# EAGLE design alexandru_ariton (EAGLE 9.7.0)
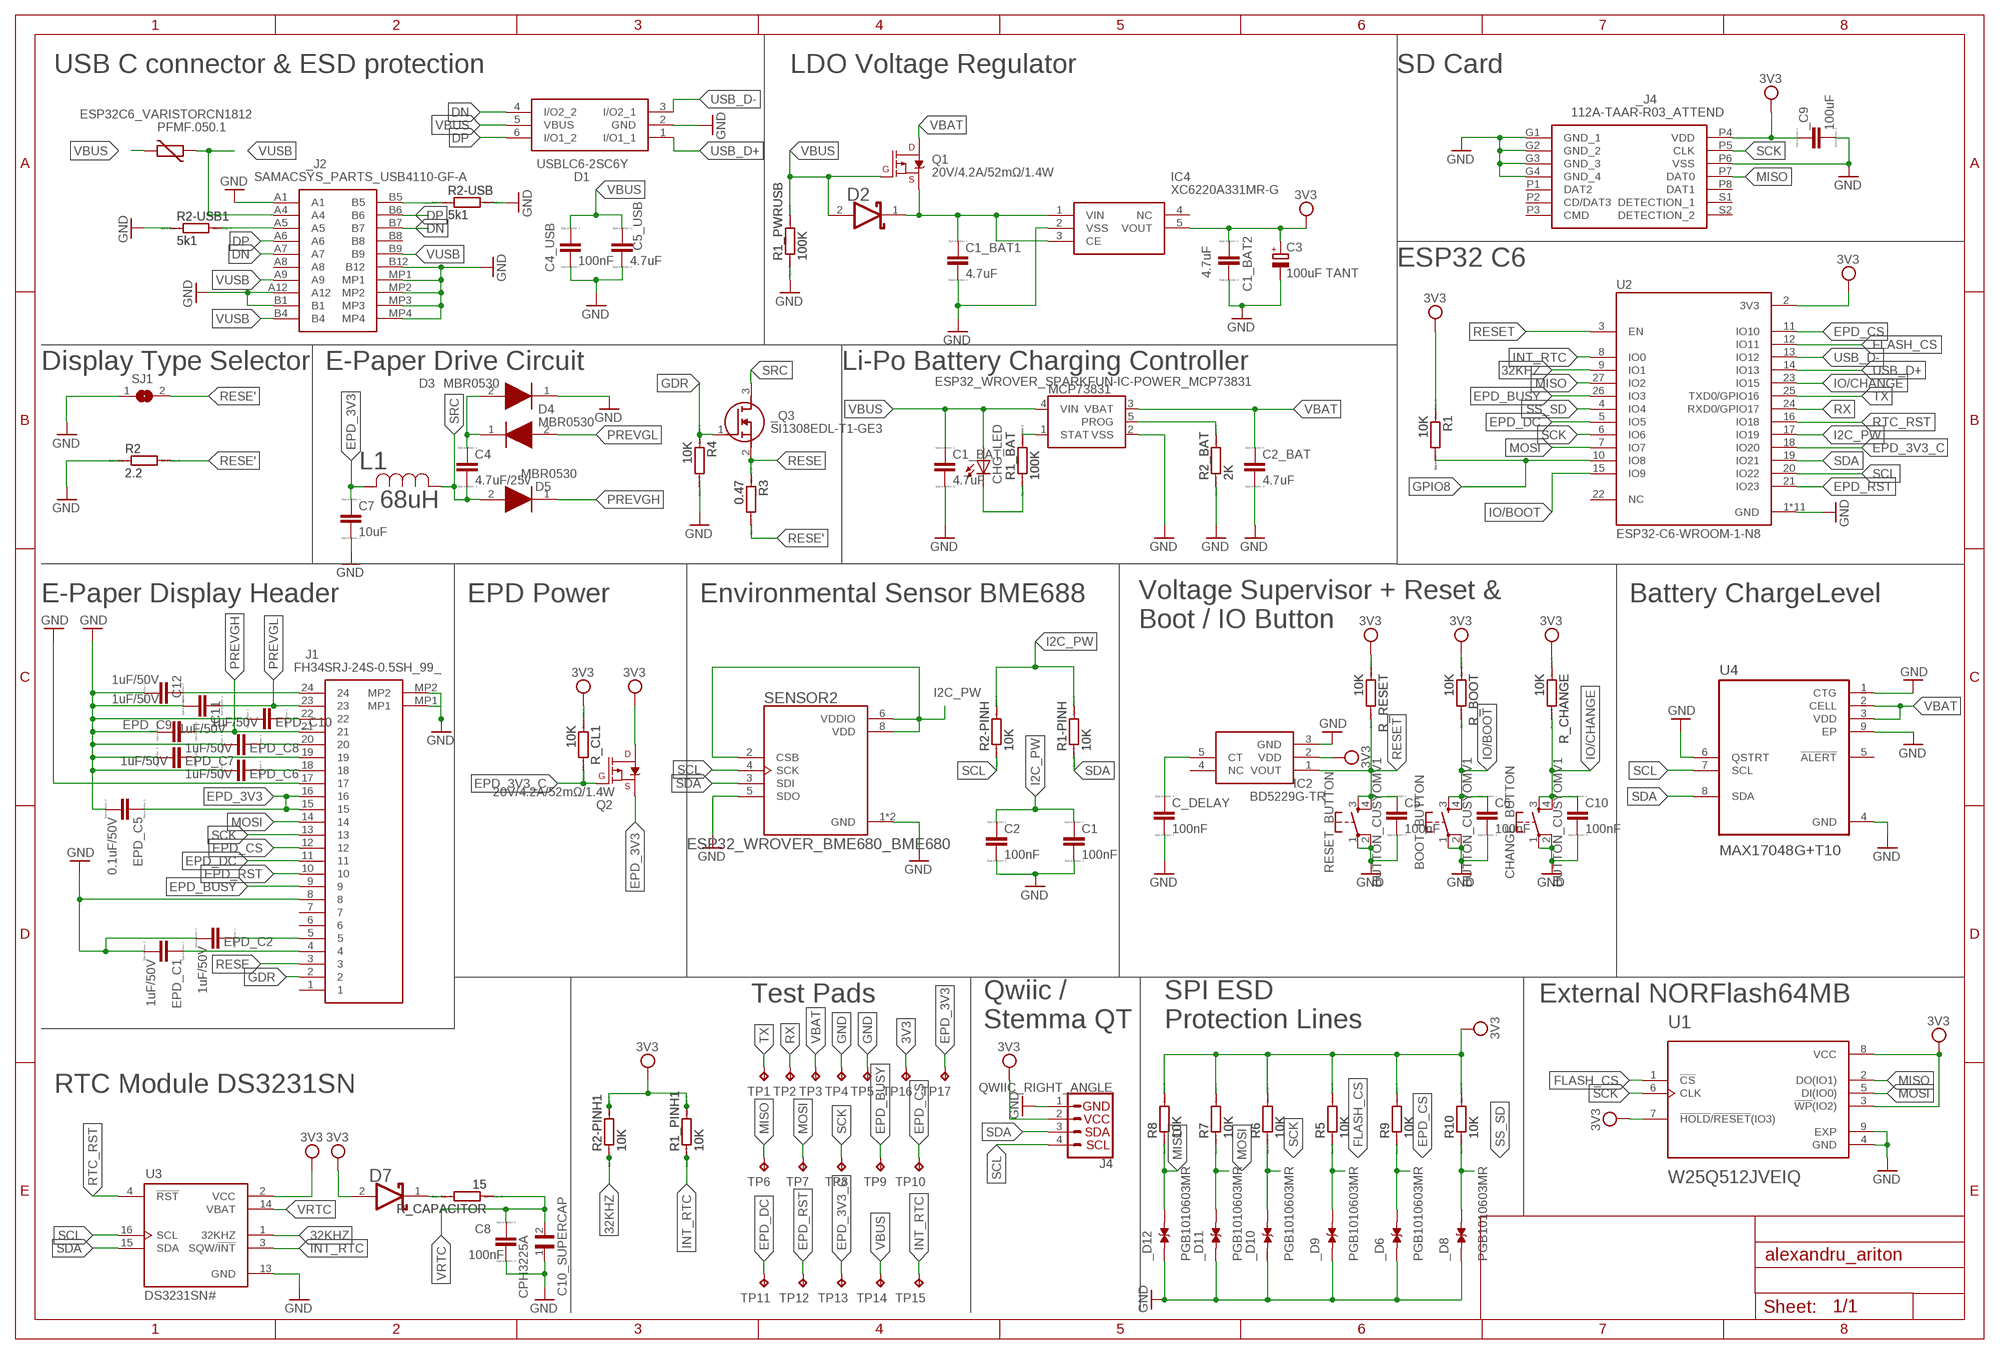
[diagram p0: schematic, sheet 1]

## Parts
_C9  100uF  EAGLE-LTSPICE_CC0402  [EAGLE-LTSPICE_C0402]
_D6  PGB1010603MR  [DIOC1608X36N]
_D8  PGB1010603MR  [DIOC1608X36N]
_D9  PGB1010603MR  [DIOC1608X36N]
_D10  PGB1010603MR  [DIOC1608X36N]
_D11  PGB1010603MR  [DIOC1608X36N]
_D12  PGB1010603MR  [DIOC1608X36N]
_J2  SAMACSYS_PARTS_USB4110-GF-A  [SAMACSYS_PARTS_USB4110GFA]
_J4  112A-TAAR-R03_ATTEND  [112ATAARR03ATTEND]
_Q3  SI1308EDL-T1-GE3  [SOT65P210X110-3N]
BOOT_BUTTON  BUTTON_CUSYOMV1  [MYBUTTON]
C1  100nF  EAGLE-LTSPICE_CC0402  [EAGLE-LTSPICE_C0402]
C1_BAT  4.7uF  EAGLE-LTSPICE_CC0402  [EAGLE-LTSPICE_C0402]
C1_BAT1  4.7uF  EAGLE-LTSPICE_CC0402  [EAGLE-LTSPICE_C0402]
C1_BAT2  4.7uF  EAGLE-LTSPICE_CC0402  [EAGLE-LTSPICE_C0402]
C2  100nF  EAGLE-LTSPICE_CC0402  [EAGLE-LTSPICE_C0402]
C2_BAT  4.7uF  EAGLE-LTSPICE_CC0402  [EAGLE-LTSPICE_C0402]
C3  100uF TANT  RCL_CPOL-EUCT3528  [RCL_CT3528]
C4  4.7uF/25v  EAGLE-LTSPICE_CC0402  [EAGLE-LTSPICE_C0402]
C4_USB  100nF  EAGLE-LTSPICE_CC0402  [EAGLE-LTSPICE_C0402]
C5  100nF  ESP32_WROVER_EAGLE-LTSPICE_CC0402  [ESP32_WROVER_EAGLE-LTSPICE_C0402]
C5_USB  4.7uF  EAGLE-LTSPICE_CC0402  [EAGLE-LTSPICE_C0402]
C6  100nF  ESP32_WROVER_EAGLE-LTSPICE_CC0402  [ESP32_WROVER_EAGLE-LTSPICE_C0402]
C7  10uF  EAGLE-LTSPICE_CC0402  [EAGLE-LTSPICE_C0402]
C8  100nF  EAGLE-LTSPICE_CC0402  [EAGLE-LTSPICE_C0402]
C10  100nF  ESP32_WROVER_EAGLE-LTSPICE_CC0402  [ESP32_WROVER_EAGLE-LTSPICE_C0402]
C10_SUPERCAP  CPH3225A  [CAPCP3225X100N]
C11  1uF/50V  EAGLE-LTSPICE_CC0402  [EAGLE-LTSPICE_C0402]
C12  1uF/50V  EAGLE-LTSPICE_CC0402  [EAGLE-LTSPICE_C0402]
C_DELAY  100nF  ESP32_WROVER_EAGLE-LTSPICE_CC0402  [ESP32_WROVER_EAGLE-LTSPICE_C0402]
CHANGE_BUTTON  BUTTON_CUSYOMV1  [MYBUTTON]
CHG_LED  ADAFRUIT_LEDCHIP-LED0603  [ADAFRUIT_CHIP-LED0603]
D1  USBLC6-2SC6Y  [SOT95P280X145-6N]
D2  ESP32_WROVER_AVX---SD0805S020S1R0_AVX_SD0805S020S1R0_0_0AVX_SD0805S020S1R0_0_0  [ESP32_WROVER_AVX---SD0805S020S1R0_AVX_SD0805S020S1R0_0]
D3  MBR0530  [SOD3716X135N]
D4  MBR0530  [SOD3716X135N]
D5  MBR0530  [SOD3716X135N]
D7  ESP32_WROVER_AVX---SD0805S020S1R0_AVX_SD0805S020S1R0_0_0AVX_SD0805S020S1R0_0_0  [ESP32_WROVER_AVX---SD0805S020S1R0_AVX_SD0805S020S1R0_0]
EPD_C1  1uF/50V  EAGLE-LTSPICE_CC0402  [EAGLE-LTSPICE_C0402]
EPD_C2  1uF/50V  EAGLE-LTSPICE_CC0402  [EAGLE-LTSPICE_C0402]
EPD_C5  0.1uF/50V  EAGLE-LTSPICE_CC0402  [EAGLE-LTSPICE_C0402]
EPD_C6  1uF/50V  EAGLE-LTSPICE_CC0402  [EAGLE-LTSPICE_C0402]
EPD_C7  1uF/50V  EAGLE-LTSPICE_CC0402  [EAGLE-LTSPICE_C0402]
EPD_C8  1uF/50V  EAGLE-LTSPICE_CC0402  [EAGLE-LTSPICE_C0402]
EPD_C9  1uF/50V  EAGLE-LTSPICE_CC0402  [EAGLE-LTSPICE_C0402]
EPD_C10  1uF/50V  EAGLE-LTSPICE_CC0402  [EAGLE-LTSPICE_C0402]
IC2  BD5229G-TR  [SOT95P280X125-5N]
IC4  XC6220A331MR-G  [SOT95P280X120-5N]
J1  FH34SRJ-24S-0.5SH_99_  [FH34SRJ24S05SH99]
J4  QWIIC_RIGHT_ANGLE  QWIIC_CONNECTORJS-1MM  [JST04_1MM_RA]
L1  68uH  744043680IND_4828-WE-TPC_WRE  [IND_4828-WE-TPC_WRE]
MCP73831  ESP32_WROVER_SPARKFUN-IC-POWER_MCP73831  [ESP32_WROVER_SPARKFUN-IC-POWER_SOT23-5]
PFMF.050.1  ESP32C6_VARISTORCN1812  [ESP32C6_VARISTOR_CT/CN1812]
Q1  20V/4.2A/52mΩ/1.4W  ESP32_WROVER_SPARKFUN-DISCRETESEMI_MOSFET_PCH-DMG2305UX-7  [ESP32_WROVER_SPARKFUN-DISCRETESEMI_SOT23-3]
Q2  20V/4.2A/52mΩ/1.4W  ESP32_WROVER_SPARKFUN-DISCRETESEMI_MOSFET_PCH-DMG2305UX-7  [ESP32_WROVER_SPARKFUN-DISCRETESEMI_SOT23-3]
R1  10K  ESP32_WROVER_EAGLE-LTSPICE_RR0402  [ESP32_WROVER_EAGLE-LTSPICE_R0402]
R1-PINH  10K  ESP32_WROVER_EAGLE-LTSPICE_RR0402  [ESP32_WROVER_EAGLE-LTSPICE_R0402]
R1_BAT  100K  ESP32_WROVER_EAGLE-LTSPICE_RR0402  [ESP32_WROVER_EAGLE-LTSPICE_R0402]
R1_PINH1  10K  ESP32_WROVER_EAGLE-LTSPICE_RR0402  [ESP32_WROVER_EAGLE-LTSPICE_R0402]
R1_PWRUSB  100K  ESP32_WROVER_EAGLE-LTSPICE_RR0402  [ESP32_WROVER_EAGLE-LTSPICE_R0402]
R2  2.2  ESP32_WROVER_EAGLE-LTSPICE_RR0402  [ESP32_WROVER_EAGLE-LTSPICE_R0402]
R2-PINH  10K  ESP32_WROVER_EAGLE-LTSPICE_RR0402  [ESP32_WROVER_EAGLE-LTSPICE_R0402]
R2-PINH1  10K  ESP32_WROVER_EAGLE-LTSPICE_RR0402  [ESP32_WROVER_EAGLE-LTSPICE_R0402]
R2-USB  5k1  ESP32_WROVER_EAGLE-LTSPICE_RR0402  [ESP32_WROVER_EAGLE-LTSPICE_R0402]
R2-USB1  5k1  ESP32_WROVER_EAGLE-LTSPICE_RR0402  [ESP32_WROVER_EAGLE-LTSPICE_R0402]
R2_BAT  2K  ESP32_WROVER_EAGLE-LTSPICE_RR0402  [ESP32_WROVER_EAGLE-LTSPICE_R0402]
R3  0.47  ESP32_WROVER_EAGLE-LTSPICE_RR0402  [ESP32_WROVER_EAGLE-LTSPICE_R0402]
R4  10K  ESP32_WROVER_EAGLE-LTSPICE_RR0402  [ESP32_WROVER_EAGLE-LTSPICE_R0402]
R5  10K  ESP32_WROVER_EAGLE-LTSPICE_RR0402  [ESP32_WROVER_EAGLE-LTSPICE_R0402]
R6  10K  ESP32_WROVER_EAGLE-LTSPICE_RR0402  [ESP32_WROVER_EAGLE-LTSPICE_R0402]
R7  10K  ESP32_WROVER_EAGLE-LTSPICE_RR0402  [ESP32_WROVER_EAGLE-LTSPICE_R0402]
R8  10K  ESP32_WROVER_EAGLE-LTSPICE_RR0402  [ESP32_WROVER_EAGLE-LTSPICE_R0402]
R9  10K  ESP32_WROVER_EAGLE-LTSPICE_RR0402  [ESP32_WROVER_EAGLE-LTSPICE_R0402]
R10  10K  ESP32_WROVER_EAGLE-LTSPICE_RR0402  [ESP32_WROVER_EAGLE-LTSPICE_R0402]
R_BOOT  10K  ESP32_WROVER_EAGLE-LTSPICE_RR0402  [ESP32_WROVER_EAGLE-LTSPICE_R0402]
R_CAPACITOR  15  ESP32_WROVER_EAGLE-LTSPICE_RR0402  [ESP32_WROVER_EAGLE-LTSPICE_R0402]
R_CHANGE  10K  ESP32_WROVER_EAGLE-LTSPICE_RR0402  [ESP32_WROVER_EAGLE-LTSPICE_R0402]
R_CL1  10K  ESP32_WROVER_EAGLE-LTSPICE_RR0402  [ESP32_WROVER_EAGLE-LTSPICE_R0402]
R_RESET  10K  ESP32_WROVER_EAGLE-LTSPICE_RR0402  [ESP32_WROVER_EAGLE-LTSPICE_R0402]
RESET_BUTTON  BUTTON_CUSYOMV1  [MYBUTTON]
SENSOR2  ESP32_WROVER_BME680_BME680  [ESP32_WROVER_BME680_PSON80P300X300X100-8N]
SJ1  SJ  [SJ]
TP1  TPTP20R  [TP20R]
TP2  TPTP20R  [TP20R]
TP3  TPTP20R  [TP20R]
TP4  TPTP20R  [TP20R]
TP5  TPTP20R  [TP20R]
TP6  TPTP20R  [TP20R]
TP7  TPTP20R  [TP20R]
TP8  TPTP20R  [TP20R]
TP9  TPTP20R  [TP20R]
TP10  TPTP20R  [TP20R]
TP11  TPTP20R  [TP20R]
TP12  TPTP20R  [TP20R]
TP13  TPTP20R  [TP20R]
TP14  TPTP20R  [TP20R]
TP15  TPTP20R  [TP20R]
TP16  TPTP20R  [TP20R]
TP17  TPTP20R  [TP20R]
U1  W25Q512JVEIQ  [SON127P600X800X80-9N]
U2  ESP32-C6-WROOM-1-N8  [XCVR_ESP32-C6-WROOM-1-N8]
U3  DS3231SN#  [SOIC127P1032X265-16N]
U4  MAX17048G+T10  [SON50P200X200X80-9N]

## Nets
3V3 [Semnale de Putere]: _C9.1 _J4.P4(VDD) C1_BAT2.1 C3.+ D7.2(ANODE) IC2.2(VDD) IC4.5(VOUT) J4.2 Q2.3(D) R1.1 R1_PINH1.2 R2-PINH1.2 R5.2 R6.2 R7.2 R8.2 R9.2 R10.2 R_BOOT.1 R_CHANGE.1 R_CL1.1 R_RESET.1 TP16.TP U1.3(!WP!(IO2)) U1.7(!HOLD!/!RESET!(IO3)) U1.8(VCC) U2.2(3V3) U3.2(VCC)
32KHZ: R2-PINH1.1 U2.9(IO1) U3.1(32KHZ)
DN: _J2.A7 _J2.B7 D1.4(I/O2_2)
DP: _J2.A6 _J2.B6 D1.6(I/O1_2)
EPD_3V3 [Semnale de Putere]: C7.1 EPD_C5.1 J1.15 J1.16 L1.2 Q2.2(S) TP17.TP
EPD_3V3_C [Semnale de Putere]: Q2.1(G) R_CL1.2 TP13.TP U2.18(IO20)
EPD_BUSY: J1.9 TP9.TP U2.26(IO3)
EPD_CS: _D6.2 J1.12 R9.1 TP10.TP U2.11(IO10)
EPD_DC: J1.11 TP11.TP U2.5(IO5)
EPD_RST: J1.10 TP12.TP U2.21(IO23)
FLASH_CS: _D9.2 R5.1 U1.1(!CS) U2.12(IO11)
GDR: _Q3.1(G) J1.2 R4.1
GND: _C9.2 _D6.1 _D8.1 _D9.1 _D10.1 _D11.1 _D12.1 _J2.A1 _J2.A12 _J2.B1 _J2.B12 _J2.MP1 _J2.MP2 _J2.MP3 _J2.MP4 _J4.G1(GND_1) _J4.G2(GND_2) _J4.G3(GND_3) _J4.G4(GND_4) _J4.P6(VSS) BOOT_BUTTON.1 BOOT_BUTTON.2 C1.2 C1_BAT1.2 C1_BAT2.2 C1_BAT.2 C2.2 C2_BAT.2 C3.- C4_USB.2 C5.2 C5_USB.2 C6.2 C7.2 C8.2 C10.2 C10_SUPERCAP.1 C11.2 C12.2 C_DELAY.2 CHANGE_BUTTON.1 CHANGE_BUTTON.2 D1.2(GND) D3.1(K) EPD_C1.2 EPD_C2.2 EPD_C5.2 EPD_C6.2 EPD_C7.2 EPD_C8.2 EPD_C9.2 EPD_C10.2 IC2.3(GND) IC4.2(VSS) J1.8 J1.17 J1.MP1 J1.MP2 J4.1 MCP73831.2(VSS) R1_PWRUSB.1 R2-USB1.1 R2-USB.2 R2.1 R2_BAT.1 R4.2 RESET_BUTTON.1 RESET_BUTTON.2 SENSOR2.1(GND) SENSOR2.5(SDO) SENSOR2.7(GND) SJ1.1 TP4.TP TP5.TP U1.4(GND) U1.9(EXP) U2.1(GND) U2.28(GND) U2.29_1(GND) U2.29_2(GND) U2.29_3(GND) U2.29_4(GND) U2.29_5(GND) U2.29_6(GND) U2.29_7(GND) U2.29_8(GND) U2.29_9(GND) U3.13(GND) U4.1(CTG) U4.4(GND) U4.6(QSTRT) U4.9(EP)
GPIO8: R1.2 U2.10(IO8)
I2C_PW: C1.1 C2.1 R1-PINH.2 R2-PINH.2 SENSOR2.2(CSB) SENSOR2.6(VDDIO) SENSOR2.8(VDD) U2.17(IO19)
INT_RTC: R1_PINH1.1 TP15.TP U2.8(IO0) U3.3(SQW/!INT)
IO/BOOT: BOOT_BUTTON.3 BOOT_BUTTON.4 C6.1 R_BOOT.2 U2.15(IO9)
IO/CHANGE: C10.1 CHANGE_BUTTON.3 CHANGE_BUTTON.4 R_CHANGE.2 U2.23(IO15)
MISO: _D12.2 _J4.P7(DAT0) R8.1 TP6.TP U1.2(DO(IO1)) U2.27(IO2)
MOSI: _D11.2 J1.14 R7.1 TP7.TP U1.5(DI(IO0)) U2.7(IO7)
N$1: _J2.B5 R2-USB.1
N$3: _J2.A5 R2-USB1.2
N$4: C1_BAT1.1 D2.1(CATHODE) IC4.1(VIN) IC4.3(CE) Q1.2(S)
N$5: MCP73831.1(STAT) R1_BAT.2
N$6: C4.1 D3.2(A) D4.1(K)
N$7: CHG_LED.C R1_BAT.1
N$8: MCP73831.5(PROG) R2_BAT.2
N$9: C12.1 J1.24
N$11: EPD_C10.1 J1.22
N$13: EPD_C8.1 J1.20
N$14: EPD_C7.1 J1.19
N$15: EPD_C6.1 J1.18
N$16: D7.1(CATHODE) R_CAPACITOR.2
N$19: C_DELAY.1 IC2.5(CT)
N$22: EPD_C1.1 J1.4
N$23: EPD_C2.1 J1.5
PREVGH: D5.1(K) EPD_C9.1 J1.21
PREVGL: C11.1 D4.2(A) J1.23
RESE: _Q3.2(S) J1.3 R3.1
RESE': R2.2 R3.2 SJ1.2
RESET: C5.1 IC2.1(VOUT) R_RESET.2 RESET_BUTTON.3 RESET_BUTTON.4 U2.3(EN)
RTC_RST: U2.16(IO18) U3.4(!RST)
RX: TP2.TP U2.24(RXD0/GPIO17)
SCK: _D10.2 _J4.P5(CLK) J1.13 R6.1 TP8.TP U1.6(CLK) U2.6(IO6)
SCL: J4.4 R2-PINH.1 SENSOR2.4(SCK) U2.20(IO22) U3.16(SCL) U4.7(SCL)
SDA: J4.3 R1-PINH.1 SENSOR2.3(SDI) U2.19(IO21) U3.15(SDA) U4.8(SDA)
SRC: _Q3.3(D) C4.2 D5.2(A) L1.1
SS_SD: _D8.2 R10.1 U2.4(IO4)
TX: TP1.TP U2.25(TXD0/GPIO16)
USB_D+: D1.1(I/O1_1) U2.14(IO13)
USB_D-: D1.3(I/O2_1) U2.13(IO12)
VBAT [Semnale de Putere]: C2_BAT.1 MCP73831.3(VBAT) Q1.3(D) TP3.TP U4.2(CELL) U4.3(VDD)
VBUS [Semnale de Putere]: C1_BAT.1 C4_USB.1 C5_USB.1 CHG_LED.A D1.5(VBUS) D2.2(ANODE) MCP73831.4(VIN) PFMF.050.1.2 Q1.1(G) R1_PWRUSB.2 TP14.TP
VRTC [Semnale de Putere]: C8.1 C10_SUPERCAP.2 R_CAPACITOR.1 U3.14(VBAT)
VUSB [Semnale de Putere]: _J2.A4 _J2.A9 _J2.B4 _J2.B9 PFMF.050.1.1
Unconnected: _J2.A8 _J2.B8 _J4.P1(DAT2) _J4.P2(CD/DAT3) _J4.P3(CMD) _J4.P8(DAT1) _J4.S1(DETECTION_1) _J4.S2(DETECTION_2) IC2.4(NC) IC4.4(NC) J1.1 J1.6 J1.7 U2.22(NC) U4.5(!ALERT)

## Notes on the sheet
- USB C connector & ESD protection | LDO Voltage Regulator | SD Card
- ESP32 C6
- Display Type Selector | E-Paper Drive Circuit | Li-Po Battery Charging Controller
- E-Paper Display Header | EPD Power | Environmental Sensor BME688 | Battery ChargeLevel
- Voltage Supervisor + Reset &
  Boot / IO Button
- Test Pads | External NORFlash64MB
- Qwiic /
  Stemma QT
- SPI ESD 
  Protection Lines
- RTC Module DS3231SN

## Library data of the parts
_C9 C1 C1_BAT C1_BAT1 C1_BAT2 C2 C2_BAT C4 C4_USB C5_USB C7 C8 C11 C12 EPD_C1 EPD_C2 EPD_C5-EPD_C10 = DeskAssistant v19 v1:EAGLE-LTSPICE_C: CAPACITOR, European symbol; SPICEMODEL: NONE; SPICEPREFIX: C
_D6 _D8-_D12 = DeskAssistant v19 v1:PGB1010603MR: Check availability <https://pricing.snapeda.com/parts/PGB1010603MR/Littelfuse%20Inc./view-part?ref=eda>; AVAILABILITY: In Stock; CHECK_PRICES: https://www.snapeda.com/parts/PGB1010603MR/Littelfuse/view-part/?ref=eda; DESCRIPTION: 150V (Typ) Clamp - Ipp Tvs Diode Surface Mount 0603 (1608 Metric); MF: Littelfuse Inc.; MP: PGB1010603MR; PACKAGE: 0603 Littelfuse Inc.; PRICE: None; PURCHASE-URL: https://www.snapeda.com/api/url_track_click_mouser/?unipart_id=5659453&manufacturer=Littelfuse Inc.&part_name=PGB1010603MR&search_term=None; SNAPEDA_LINK: https://www.snapeda.com/parts/PGB1010603MR/Littelfuse/view-part/?ref=snap
_J2 = DeskAssistant v19 v1:SAMACSYS_PARTS_USB4110-GF-A: CONN USB 2.0 TYPE-C R/A SMT Source: Datasheet <https://gct.co/files/drawings/usb4110.pdf>; DESCRIPTION: CONN USB 2.0 TYPE-C R/A SMT; HEIGHT: 3.26mm; MANUFACTURER_NAME: GCT (GLOBAL CONNECTOR TECHNOLOGY); MANUFACTURER_PART_NUMBER: USB4110-GF-A; MOUSER_PART_NUMBER: 640-USB4110-GF-A; MOUSER_PRICE-STOCK: https://www.mouser.co.uk/ProductDetail/GCT/USB4110-GF-A?qs=KUoIvG%2F9IlYiZvIXQjyJeA%3D%3D
_J4 = DeskAssistant v19 v1:112A-TAAR-R03_ATTEND: Micro SD Card Socket, Push-Push Type, Top Mount, SMT, H=1.83mm, 10u Source: Datasheet <https://www.attend.com.tw/data/download/file/112A-TAAR-R03.pdf>; DESCRIPTION: Micro SD Card Socket, Push-Push Type, Top Mount, SMT, H=1.83mm, 10u; HEIGHT: 1.9mm; MANUFACTURER_NAME: ATTEND; MANUFACTURER_PART_NUMBER: 112A-TAAR-R03 ATTEND
_Q3 = DeskAssistant v19 v1:SI1308EDL-T1-GE3: MOSFET N-Ch 30V 1.5A TrenchFET SC70 Vishay Si1308EDL-T1-GE3 N-channel MOSFET Transistor, 1.5 A, 30 V, 3-Pin SC-70 Source: Datasheet <https://componentsearchengine.com/Datasheets/1/SI1308EDL-T1-GE3.pdf> Check availability <https://pricing.snapeda.com/parts/SI1308EDL-T1-GE3/Vishay%20Siliconix/view-part?ref=eda>; AVAILABILITY: In Stock; CHECK_PRICES: https://www.snapeda.com/parts/SI1308EDL-T1-GE3/Vishay+Siliconix/view-part/?ref=eda; DESCRIPTION: Si1308EDL-T1-GE3 N-channel MOSFET Transistor, 1.5 A, 30 V, 3-Pin SC-70 | Siliconix / Vishay SI1308EDL-T1-GE3; MF: Vishay Siliconix; MP: SI1308EDL-T1-GE3; PACKAGE: SOT-323 Vishay Semiconductor; PRICE: None; PURCHASE-URL: https://www.snapeda.com/api/url_track_click_mouser/?unipart_id=274603&manufacturer=Vishay Siliconix&part_name=SI1308EDL-T1-GE3&search_term=None; SNAPEDA_LINK: https://www.snapeda.com/parts/SI1308EDL-T1-GE3/Vishay+Siliconix/view-part/?ref=snap
BOOT_BUTTON CHANGE_BUTTON RESET_BUTTON = DeskAssistant v19 v1:BUTTON_CUSYOMV1
C3 = DeskAssistant v19 v1:RCL_CPOL-EU: POLARIZED CAPACITOR, European symbol; SPICEPREFIX: C
C5 C6 C10 C_DELAY = DeskAssistant v19 v1:ESP32_WROVER_EAGLE-LTSPICE_C: CAPACITOR, European symbol; SPICEMODEL: NONE; SPICEPREFIX: C
C10_SUPERCAP = DeskAssistant v19 v1:CPH3225A: Cap 0.011F 3.3V 1210 Flat Check availability <https://pricing.snapeda.com/parts/CPH3225A/Seiko%20Instruments/view-part?ref=eda>; AVAILABILITY: Not in stock; CHECK_PRICES: https://www.snapeda.com/parts/CPH3225A/Seiko+Instruments/view-part/?ref=eda; DESCRIPTION: 11 mF (EDLC) Supercapacitor 3.3 V 1210 (3225 Metric) - -; MF: Seiko Instruments; MP: CPH3225A; PACKAGE: 1210 Seiko; PRICE: None; PURCHASE-URL: https://www.snapeda.com/api/url_track_click_mouser/?unipart_id=562593&manufacturer=Seiko Instruments&part_name=CPH3225A&search_term=None; SNAPEDA_LINK: https://www.snapeda.com/parts/CPH3225A/Seiko+Instruments/view-part/?ref=snap
CHG_LED = DeskAssistant v19 v1:ADAFRUIT_LED: LED OSRAM: - CHIPLED LG R971, LG N971, LY N971, LG Q971, LY Q971, LO R971, LY R971 LH N974, LH R974 LS Q976, LO Q976, LY Q976 LO Q996 - Hyper CHIPLED LW Q18S LB Q993, LB Q99A, LB R99A - SideLED LS A670, LO A670, LY A670, LG A670, LP A670 LB A673, LV A673, LT A673, LW A673 LH A674 LY A675 LS A676, LA A676, LO A676, LY A676, LW A676 LS A679, LY A679, LG A679 - Hyper Micro SIDELED® LS Y876, LA Y876, LO Y876, LY Y876 LT Y87S - SmartLED LW L88C, LW L88S LB L89C, LB L89S, LG L890 LS L89K, LO L89K, LY L89K LS L896, LA L896, LO L896, LY L896 - TOPLED LS T670, LO T670, LY T670, LG T670, LP T670 LSG T670, LSP T670, LSY T670, LOP T670, LYG T670 LG T671, LOG T671, LSG T671 LB T673, LV T673, LT T673, LW T673 LH T674 LS T676, LA T676, LO T676, LY T676, LB T676, LH T676, LSB T676, LW T676 LB T67C, LV T67C, LT T67C, LS T67K, LO T67K, LY T67K, LW E67C LS E67B, LA E67B, LO E67B, LY E67B, LB E67C, LV E67C, LT E67C LW T67C LS T679, LY T679, LG T679 LS T770, LO T770, LY T770, LG T770, LP T770 LB T773, LV T773, LT T773, LW T773 LH T774 LS E675, LA E675, LY E675, LS T675 LS T776, LA T776, LO T776, LY T776, LB T776 LHGB T686 LT T68C, LB T68C - Hyper Mini TOPLED® LB M676 - Mini TOPLED Santana® LG M470 LS M47K, LO M47K, LY M47K Source: http://www.osram.convergy.de/
D1 = DeskAssistant v19 v1:USBLC6-2SC6Y: Low Cap. ESD Protection Auto SOT-23-6 STMicroelectronics USBLC6-2SC6Y, Dual Uni-Directional TVS Diode Array, 6-Pin SOT-23 Source: Datasheet <https://componentsearchengine.com/Datasheets/1/USBLC6-2SC6Y.pdf> Check availability <https://pricing.snapeda.com/parts/USBLC6-2SC6Y/STMicroelectronics/view-part?ref=eda>; AVAILABILITY: In Stock; CHECK_PRICES: https://www.snapeda.com/parts/USBLC6-2SC6Y/STMicroelectronics/view-part/?ref=eda; DESCRIPTION: 17V Clamp 5A (8/20µs) Ipp Tvs Diode Surface Mount SOT-23-6; MF: STMicroelectronics; MP: USBLC6-2SC6Y; PACKAGE: SOT-23-6 STMicroelectronics; PRICE: None; SNAPEDA_LINK: https://www.snapeda.com/parts/USBLC6-2SC6Y/STMicroelectronics/view-part/?ref=snap
D2 D7 = DeskAssistant v19 v1:ESP32_WROVER_AVX---SD0805S020S1R0_AVX_SD0805S020S1R0_0_0: Schottky Barrier Rectifier Diode; CENTROID_NOT_SPECIFIED: No; DATASHEET: http://datasheets.avx.com/schottky.pdf; DIGIKEY_DESCRIPTION: DIODE SCHOTTKY 20V 1A 0805; DIGIKEY_PART_NUMBER: 478-7800-1-ND; LEAD_FREE: yes; MF: AVX; MOUSER_PART_NUMBER: 581-SD0805S020S1R0; PACKAGE: 0805 (2012 metric); PREFIX: D; ROHS: yes; TEMPERATURE_RANGE_HIGH: +125°C; TEMPERATURE_RANGE_LOW: -55°C
D3-D5 = DeskAssistant v19 v1:MBR0530: ON SEMICONDUCTOR - MBR0530 - DIODE, SCHOTTKY, 0.5A, 30V, SOD-123 Source: Datasheet <http://www.onsemi.com/pub/Collateral/MBR0530T1-D.PDF> Check availability <https://pricing.snapeda.com/parts/MBR0530/ON%20Semiconductor/view-part?ref=eda>; AVAILABILITY: In Stock; CHECK_PRICES: https://www.snapeda.com/parts/MBR0530/Onsemi/view-part/?ref=eda; DESCRIPTION: Diode Schottky 30 V 500mA Surface Mount SOD-123; MF: ON Semiconductor; MP: MBR0530; PACKAGE: SOD-123-2 ON Semiconductor; PRICE: None; PURCHASE-URL: https://www.snapeda.com/api/url_track_click_mouser/?unipart_id=179458&manufacturer=ON Semiconductor&part_name=MBR0530&search_term=None; SNAPEDA_LINK: https://www.snapeda.com/parts/MBR0530/Onsemi/view-part/?ref=snap
IC2 = DeskAssistant v19 v1:BD5229G-TR: Voltage Detector with Adjustable Delay Time: CMOS processes are utilized to develop high precision, low current consumption CMOS reset ICs that allow arbitrary setting of the delay time. The extensive lineup includes both Nch Open Drain and CMOS output types in a wide range of detection voltages (from 2.3V to 6.0V, in 0.1V steps), enabling selection of the ideal solution based on customer requirements. In addition, the entire series is of course both lead-free and RoHS-compliant. Source: Datasheet <https://datasheet.datasheetarchive.com/originals/distributors/Datasheets_SAMA/f2b9741ef86007909f138d561a359946.pdf>; DESCRIPTION: Voltage Detector with Adjustable Delay Time: CMOS processes are utilized to develop high precision, low current consumption CMOS reset ICs that allow arbitrary setting of the delay time. The extensive lineup includes both Nch Open Drain and CMOS output types in a wide range of detection voltages (from 2.3V to 6.0V, in 0.1V steps), enabling selection of the ideal solution based on customer requirements. In addition, the entire series is of course both lead-free and RoHS-compliant.; HEIGHT: 1.25mm; MANUFACTURER_NAME: ROHM Semiconductor; MANUFACTURER_PART_NUMBER: BD5229G-TR; MOUSER_PART_NUMBER: 755-BD5229G-TR; MOUSER_PRICE-STOCK: https://www.mouser.co.uk/ProductDetail/ROHM-Semiconductor/BD5229G-TR?qs=4kLU8WoGk0vvnhrrYwdszw%3D%3D
IC4 = DeskAssistant v19 v1:XC6220A331MR-G: LDO Voltage Regulators Source: Datasheet <https://www.torexsemi.com/file/xc6220/XC6220.pdf>; DESCRIPTION: LDO Voltage Regulators; HEIGHT: 1.2mm; MANUFACTURER_NAME: Torex; MANUFACTURER_PART_NUMBER: XC6220A331MR-G; MOUSER_PART_NUMBER: 865-XC6220A331MR-G; MOUSER_PRICE-STOCK: https://www.mouser.co.uk/ProductDetail/Torex-Semiconductor/XC6220A331MR-G?qs=AsjdqWjXhJ8ZSWznL1J0gg%3D%3D
J1 = DeskAssistant v19 v1:FH34SRJ-24S-0.5SH_99_: 24 Position FFC, FPC Connector Contacts, Top and Bottom 0.020" (0.50mm) Surface Mount, Right Angle Source: Datasheet <https://www.hirose.com/en/product/document?clcode=CL0580-1255-6-99&productname=FH34SRJ-24S-0.5SH(99)&series=FH34SRJ&documenttype=2DDrawing&lang=en&documentid=0000990903>; DESCRIPTION: 24 Position FFC, FPC Connector Contacts, Top and Bottom 0.020" (0.50mm) Surface Mount, Right Angle; HEIGHT: 1.1mm; MANUFACTURER_NAME: Hirose; MANUFACTURER_PART_NUMBER: FH34SRJ-24S-0.5SH(99); MOUSER_PART_NUMBER: 798-FH34SRJ24S05SH99; MOUSER_PRICE-STOCK: https://www.mouser.co.uk/ProductDetail/Hirose-Connector/FH34SRJ-24S-0.5SH99?qs=vcbW%252B4%252BSTIpKBl5ap9J8Fw%3D%3D
J4 = DeskAssistant v19 v1:QWIIC_CONNECTOR: SparkFun I2C Standard Qwiic Connector An SMD 1mm pitch JST connector makes it easy and quick (get it? Qwiic?) to connect I2C devices to each other. The Qwiic system <http://www.sparkfun.com/qwiic> enables fast and solderless connection between popular platforms and various sensors and actuators. We carry 200mm <https://www.sparkfun.com/products/14204>, 100mm <https://www.sparkfun.com/products/14205>, 50mm <https://www.sparkfun.com/products/14206>, and breadboard friendly <https://www.sparkfun.com/products/14207> Qwiic cables. We also offer 10 pcs strips <https://www.sparkfun.com/products/14323> the SMD connectors.; PROD_ID: CONN-13694
L1 = DeskAssistant v19 v1:744043680; COPYRIGHT: Copyright (C) 2024 Ultra Librarian. All rights reserved.; MANUFACTURER_PART_NUMBER: 744043680; MFR_NAME: Wurth Electronics
MCP73831 = DeskAssistant v19 v1:ESP32_WROVER_SPARKFUN-IC-POWER_MCP73831: MCP73831T Li-Ion, Li-Pol Controller Miniature single cell, fully integrated Li-Ion, Li-polymer charge management controller Datasheet <http://ww1.microchip.com/downloads/en/DeviceDoc/20001984g.pdf> SparkFun Products: SparkFun ESP32 Thing <https://www.sparkfun.com/products/13907> SparkFun 9DoF Razor IMU M0 <https://www.sparkfun.com/products/14001>; PROD_ID: IC-09995
PFMF.050.1 = DeskAssistant v19 v1:ESP32C6_VARISTOR: VARISTOR
Q1 Q2 = DeskAssistant v19 v1:ESP32_WROVER_SPARKFUN-DISCRETESEMI_MOSFET_PCH: P-channel MOSFETs Voltage controlled devices that allow control of high current outputs. SparkFun Products: SparkFun ESP32 Thing <https://www.sparkfun.com/products/13907> SparkFun ESP8266 Thing <https://www.sparkfun.com/products/13231> SparkFun Pi Servo HAT V2 <https://www.sparkfun.com/products/15316> DMG2305UX-7 (20V/4.2A/SOT23-3); PROD_ID: TRAN-14388
R1 R1-PINH R1_BAT R1_PINH1 R1_PWRUSB R2 R2-PINH R2-PINH1 R2-USB R2-USB1 R2_BAT R3-R10 R_BOOT R_CAPACITOR R_CHANGE R_CL1 R_RESET = DeskAssistant v19 v1:ESP32_WROVER_EAGLE-LTSPICE_R: RESISTOR, European symbol; SPICEMODEL: NONE; SPICEPREFIX: R
SENSOR2 = DeskAssistant v19 v1:ESP32_WROVER_BME680_BME680: Integrated Environmental Unit; AVAILABILITY: Unavailable; DESCRIPTION: Integrated Environmental Unit; MF: Bosch Sensortec; MP: BME680; PACKAGE: LGA-8 Bosch Tools; PRICE: None
SJ1 = DeskAssistant v19 v1:SJ: SMD solder JUMPER
TP1-TP17 = DeskAssistant v19 v1:TP: Test pad
U1 = DeskAssistant v19 v1:W25Q512JVEIQ: Check availability <https://pricing.snapeda.com/parts/W25Q512JVEIQ/Winbond%20Electronics/view-part?ref=eda>; AVAILABILITY: In Stock; CHECK_PRICES: https://www.snapeda.com/parts/W25Q512JVEIQ/Winbond+Electronics/view-part/?ref=eda; DESCRIPTION: FLASH - NOR Memory IC 512Mb (64M x 8) SPI - Quad I/O 133 MHz 8-WSON (8x6); MF: Winbond Electronics; MP: W25Q512JVEIQ; PACKAGE: Package; PRICE: None; SNAPEDA_LINK: https://www.snapeda.com/parts/W25Q512JVEIQ/Winbond+Electronics/view-part/?ref=snap
U2 = DeskAssistant v19 v1:ESP32-C6-WROOM-1-N8: Check availability <https://pricing.snapeda.com/parts/ESP32-C6-WROOM-1-N8/Espressif%20Systems/view-part?ref=eda>; AVAILABILITY: In Stock; CHECK_PRICES: https://www.snapeda.com/parts/ESP32-C6-WROOM-1-N8/Espressif+Systems/view-part/?ref=eda; DESCRIPTION: Multiprotocol Modules ESP32-C6 module, Wi-Fi 6 in 2.4 GHz band, Bluetooth 5, Zigbee 3.0 and Thread. ESP34-WROOM Compatible - ENGINEERING SAMPLE; MF: Espressif Systems; MP: ESP32-C6-WROOM-1-N8; PACKAGE: None; PRICE: None; SNAPEDA_LINK: https://www.snapeda.com/parts/ESP32-C6-WROOM-1-N8/Espressif+Systems/view-part/?ref=snap
U3 = DeskAssistant v19 v1:DS3231SN#: Real Time Clock Serial 16-Pin SOIC W T/R Check availability <https://pricing.snapeda.com/parts/DS3231SN%23/Analog%20Devices/view-part?ref=eda>; AVAILABILITY: In Stock; CHECK_PRICES: https://www.snapeda.com/parts/DS3231SN%23/Analog+Devices/view-part/?ref=eda; DESCRIPTION: Extremely Accurate I²C-Integrated RTC/TCXO/Crystal; MF: Analog Devices; MP: DS3231SN#; PACKAGE: SOIC-16 Maxim; PRICE: None; PURCHASE-URL: https://www.snapeda.com/api/url_track_click_mouser/?unipart_id=99048&manufacturer=Analog Devices&part_name=DS3231SN#&search_term=None; SNAPEDA_LINK: https://www.snapeda.com/parts/DS3231SN%23/Analog+Devices/view-part/?ref=snap
U4 = DeskAssistant v19 v1:MAX17048G+T10: Check availability <https://pricing.snapeda.com/parts/MAX17048G%2BT10/Analog%20Devices/view-part?ref=eda>; AVAILABILITY: In Stock; CHECK_PRICES: https://www.snapeda.com/parts/MAX17048G+T10/Analog+Devices/view-part/?ref=eda; DESCRIPTION: 3µA 1-Cell/2-Cell Fuel Gauge with ModelGauge; MF: Analog Devices; MP: MAX17048G+T10; PACKAGE: TDFN-8 Maxim; PRICE: None; PURCHASE-URL: https://www.snapeda.com/api/url_track_click_mouser/?unipart_id=329239&manufacturer=Analog Devices&part_name=MAX17048G+T10&search_term=None; SNAPEDA_LINK: https://www.snapeda.com/parts/MAX17048G+T10/Analog+Devices/view-part/?ref=snap

## Net classes
1 Semnale de Putere: width 0.3 mm

## Board
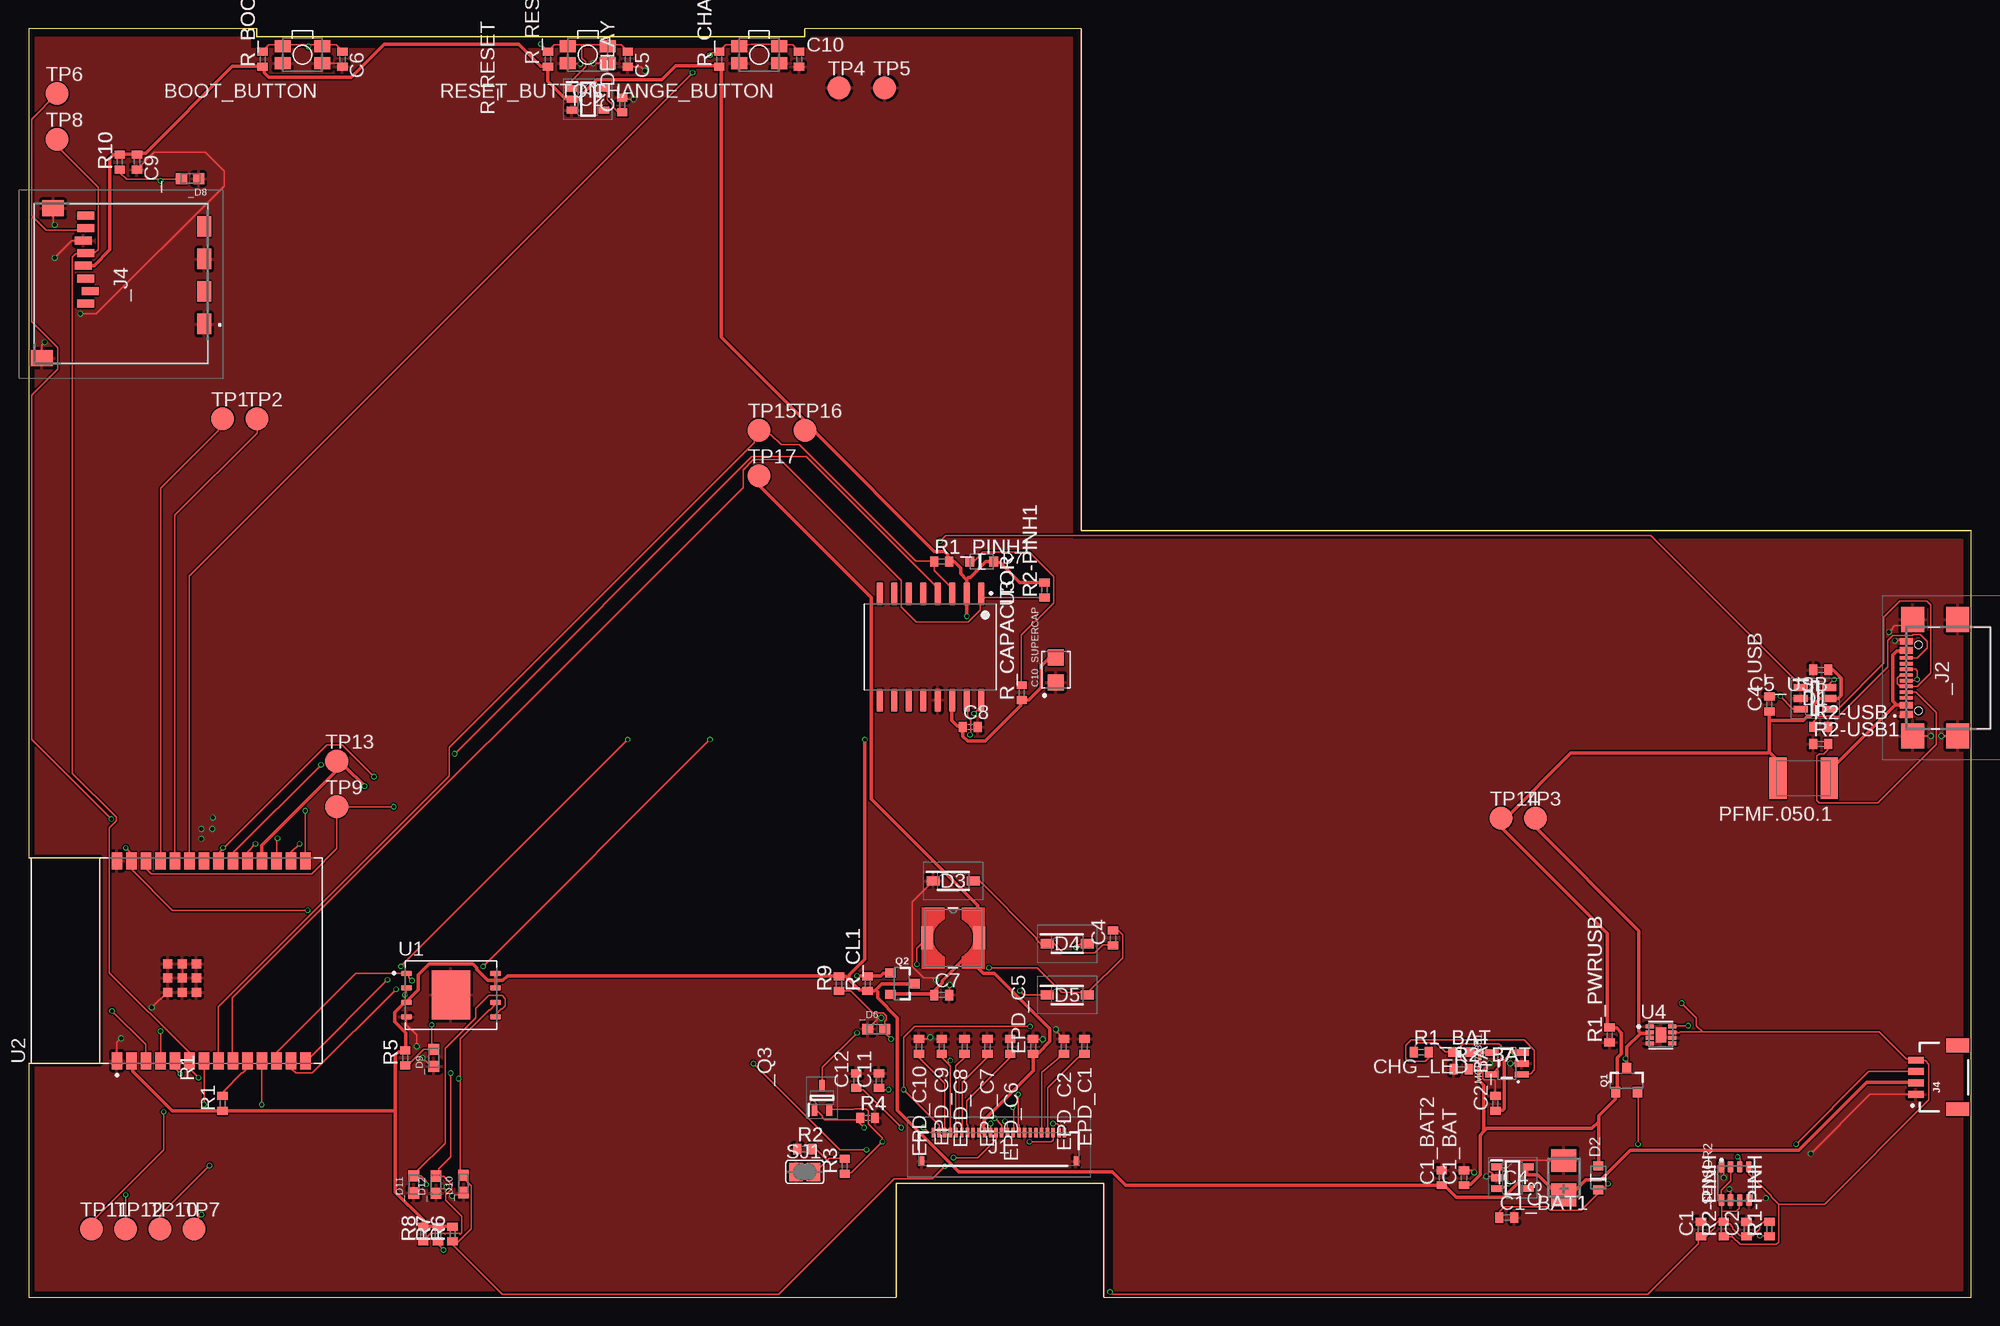
[diagram p1: board, top side]
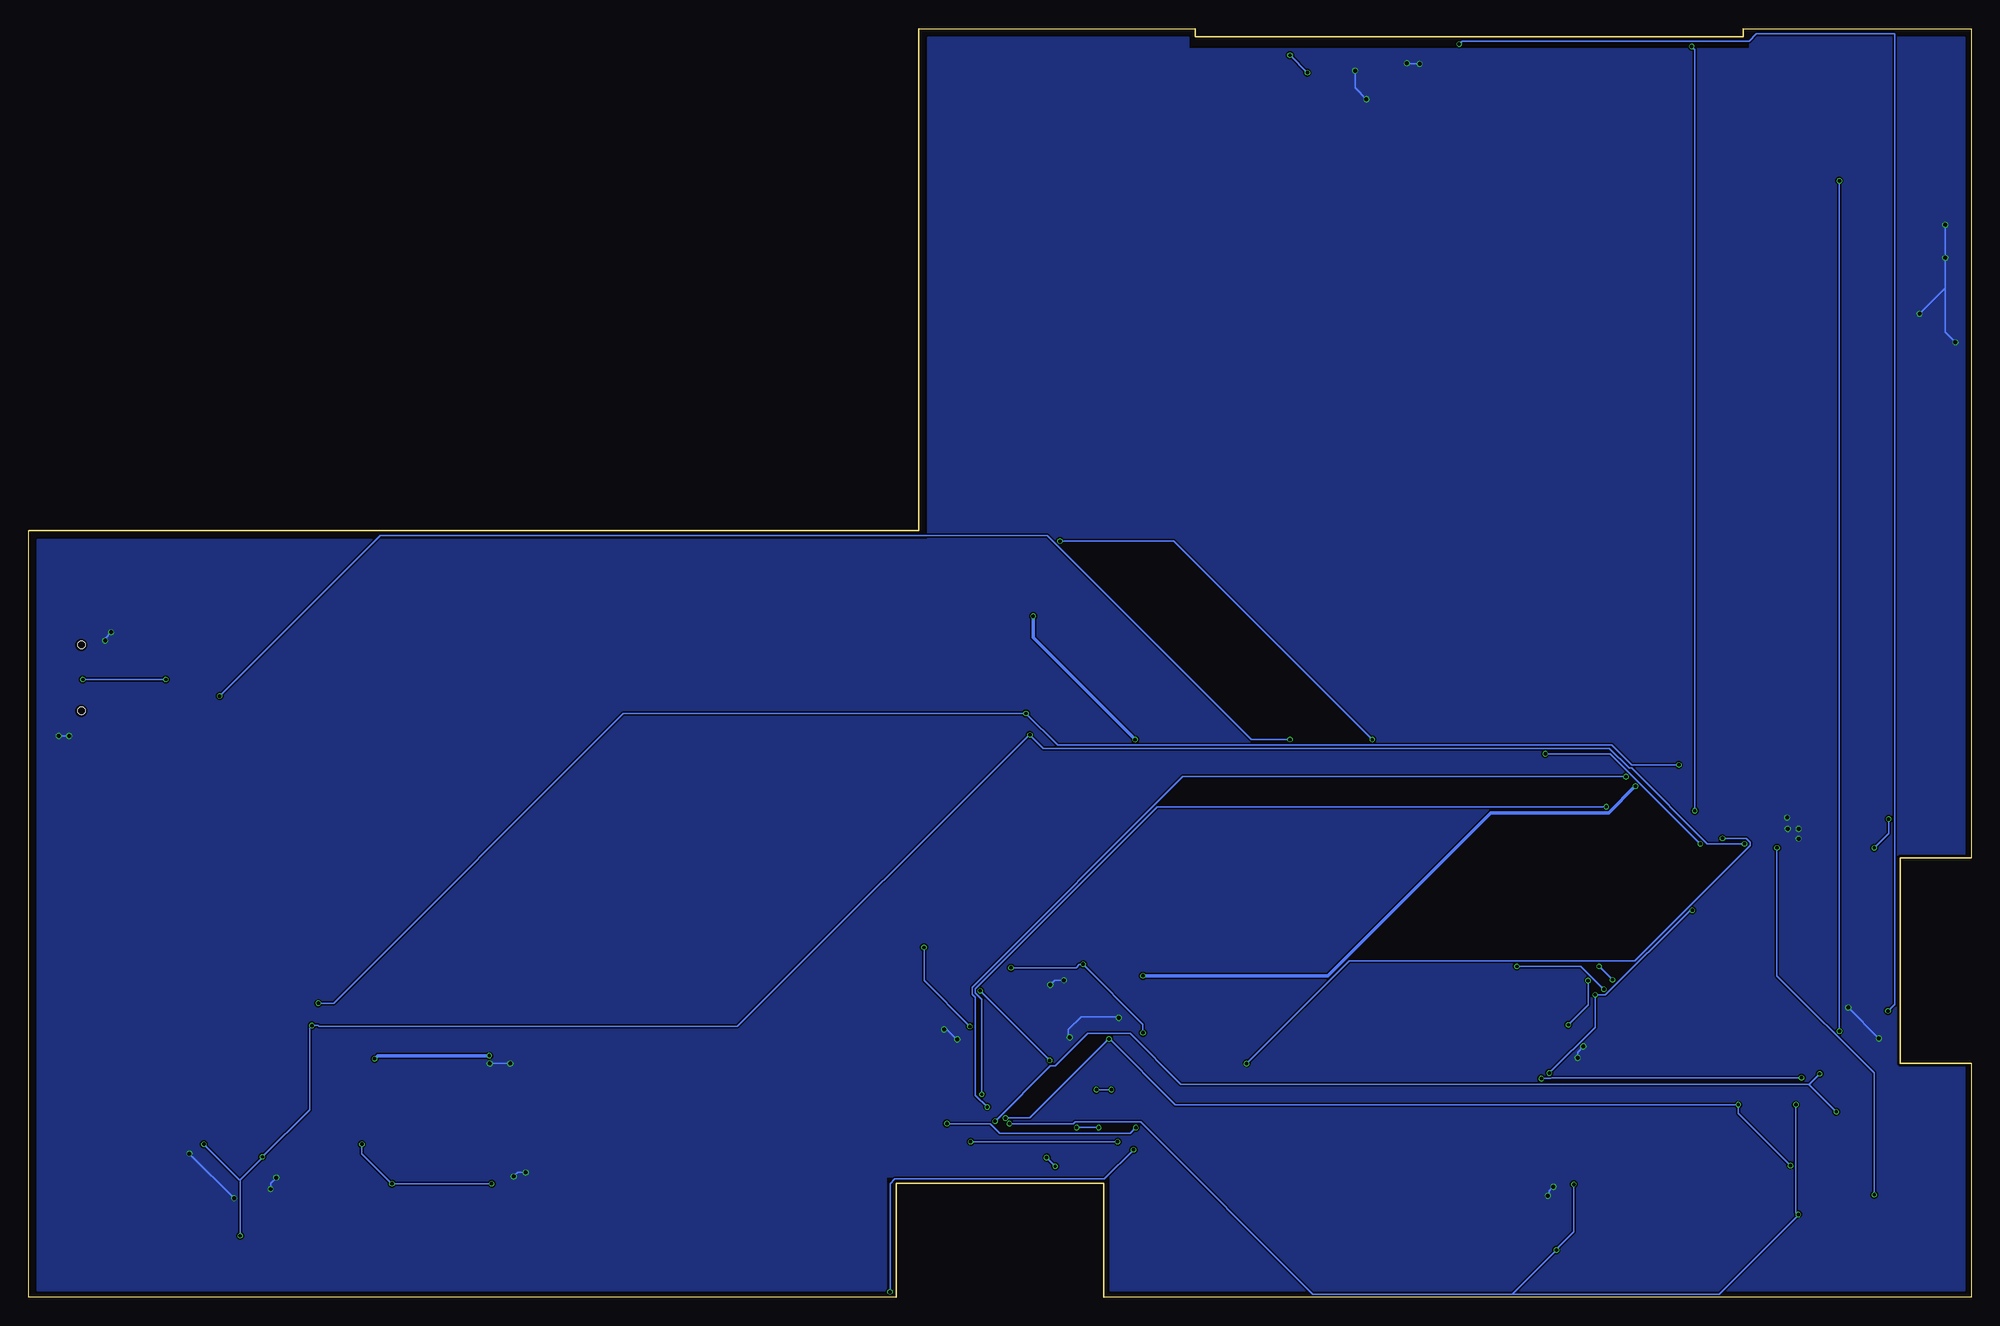
[diagram p2: board, bottom side, seen from below]

Size 170.2 x 111.2 mm. Coordinates in mm from the lower left corner, seen from the top.
Outline: 0,0 76,0 76,10 94.2,10 94.2,0 170.2,0 170.2,67.2 92.2,67.2 92.2,111.2 68,111.2 68,110.5 20,110.5 20,111.2 0,111.2 0,38.5 6.25,38.5 6.25,20.5 0,20.5 0,0
Copper layers (1*16): Top 0.035mm / dielectric 1.6mm / Bottom 0.035mm
Design rules "jlcpcb-2layers.dru": minimum track width 0.15mm, minimum drill 0.3mm, track to track 5mil, track to pad 5mil, pad to pad 5mil, via to via 5mil, smd to smd 5mil, copper to edge 0.2mm, drill to drill 6mil, minimum pad ring 10mil, minimum via ring 3mil, stop-mask expansion 4mil, vias tented up to drill 0mil, thermal gap 10mil

### Footprints (pad centres in the part's own frame; a part is rotated, then mirrored left to right if it is on the bottom)
EAGLE-LTSPICE_C0402 = smd 0.7 x 0.9: 1 -0.65,0; 2 0.65,0
DIOC1608X36N = smd 0.97 x 0.94: 1 -0.75,0; 2 0.75,0
SAMACSYS_PARTS_USB4110GFA = smd 0.3 x 1.15: A1 -3.35,3.678; A4 -2.55,3.678; A5 -1.25,3.678; A6 -0.25,3.678; A7 0.25,3.678; A8 1.25,3.678; A9 2.55,3.678; A12 3.35,3.678; B4 2.25,3.678; B5 1.75,3.678; B6 0.75,3.678; B7 -0.75,3.678; B8 -1.75,3.678; B9 -2.25,3.678 | smd 0.3 x 1.092: B1 3.05,3.678; B12 -3.05,3.678 | smd 2.18 x 2: MP1 -5.11,-0.827; MP2 5.11,-0.827; MP3 -5.11,3.103; MP4 5.11,3.103 | hole 0.65: -2.89,2.603; 2.89,2.603
112ATAARR03ATTEND = smd 1.8 x 1.2: G1 10.6,10.4; G2 4.9,10.4; S1 7.75,10.4; S2 2.05,10.4 | smd 1.4 x 1.9: G3 13.6,-3.85; G4 0.45,-2.85 | smd 0.7 x 1.5: P1 8.8,0; P2 7.7,0.4; P3 6.6,0; P4 5.5,-0.2; P5 4.4,0; P6 3.3,-0.2; P7 2.2,0; P8 1.1,0
SOT65P210X110-3N = smd 1.05 x 0.5: 1 -1.05,0.65; 2 -1.05,-0.65; 3 1.05,0
MYBUTTON = smd 1.4 x 1.05: 1 1.75,0.75; 2 -1.75,0.75; 3 -1.75,-0.75; 4 1.75,-0.75
RCL_CT3528 = smd 2 x 2.2: + -1.5,0; - 1.5,0
ESP32_WROVER_EAGLE-LTSPICE_C0402 = smd 0.7 x 0.9: 1 -0.65,0; 2 0.65,0
CAPCP3225X100N = smd 1.4 x 1.4: 1 -1.1,0; 2 1.1,0
ADAFRUIT_CHIP-LED0603 = smd 0.8 x 0.8: A 0,-0.75; C 0,0.75
SOT95P280X145-6N = smd 1.2 x 0.6: 1 -1.25,0.95; 2 -1.25,0; 3 -1.25,-0.95; 4 1.25,-0.95; 5 1.25,0; 6 1.25,0.95
ESP32_WROVER_AVX---SD0805S020S1R0_AVX_SD0805S020S1R0_0 = smd 0.8 x 0.9: 1 -1.05,0; 2 1.05,0
SOD3716X135N = smd 1.15 x 0.8: 1 -1.75,0; 2 1.75,0
SOT95P280X125-5N = smd 0.9 x 0.6: 1 -1.4,0.95; 2 -1.4,0; 3 -1.4,-0.95; 4 1.4,-0.95; 5 1.4,0.95
SOT95P280X120-5N = smd 0.9 x 0.6: 1 -1.4,0.95; 2 -1.4,0; 3 -1.4,-0.95; 4 1.4,-0.95; 5 1.4,0.95
FH34SRJ24S05SH99 = smd 0.3 x 0.8: 1 5.75,1.45; 2 5.25,1.45; 3 4.75,1.45; 4 4.25,1.45; 5 3.75,1.45; 6 3.25,1.45; 7 2.75,1.45; 8 2.25,1.45; 9 1.75,1.45; 10 1.25,1.45; 11 0.75,1.45; 12 0.25,1.45; 13 -0.25,1.45; 14 -0.75,1.45; 15 -1.25,1.45; 16 -1.75,1.45; 17 -2.25,1.45; 18 -2.75,1.45; 19 -3.25,1.45; 20 -3.75,1.45; 21 -4.25,1.45; 22 -4.75,1.45; 23 -5.25,1.45; 24 -5.75,1.45 | smd 0.4 x 0.8: MP1 6.75,-1.05; MP2 -6.75,-1.05
JST04_1MM_RA = smd 0.6 x 1.35: 1 -1.5,0; 2 -0.5,0; 3 0.5,0; 4 1.5,0 | smd 1.2 x 2: NC1 2.8,-3.675; NC2 -2.8,-3.675
IND_4828-WE-TPC_WRE = smd 1.016 x 2.032: 1 -2.286,0; 2 2.286,0
ESP32_WROVER_SPARKFUN-IC-POWER_SOT23-5 = smd 0.55 x 1.2: 1 -0.95,-1.3; 2 0,-1.3; 3 0.95,-1.3; 4 0.95,1.3; 5 -0.95,1.3
ESP32C6_VARISTOR_CT/CN1812 = smd 1.5 x 3.6: 1 -2.25,0; 2 2.25,0
ESP32_WROVER_SPARKFUN-DISCRETESEMI_SOT23-3 = smd 0.8 x 0.9: 1 -0.95,-1; 2 0.95,-1; 3 0,1.1
ESP32_WROVER_EAGLE-LTSPICE_R0402 = smd 0.7 x 0.9: 1 -0.65,0; 2 0.65,0
ESP32_WROVER_BME680_PSON80P300X300X100-8N = smd 1.016 x 0.5: 1 1.458,1.2; 2 1.458,0.4; 3 1.458,-0.4; 4 1.458,-1.2; 5 -1.458,-1.22; 6 -1.458,-0.4; 7 -1.458,0.4; 8 -1.458,1.2
SJ = smd 1.168 x 1.6: 1 -0.762,0; 2 0.762,0
TP20R = smd 2 x 2: TP 0,0
SON127P600X800X80-9N = smd 0.94 x 0.44: 1 -3.895,1.905; 2 -3.895,0.635; 3 -3.895,-0.635; 4 -3.895,-1.905; 5 3.895,-1.905; 6 3.895,-0.635; 7 3.895,0.635; 8 3.895,1.905 | smd 3.4 x 4.3: 9 0,0
XCVR_ESP32-C6-WROOM-1-N8 = smd 1.5 x 0.9: 1 -8.75,5.26; 2 -8.75,3.99; 3 -8.75,2.72; 4 -8.75,1.45; 5 -8.75,0.18; 6 -8.75,-1.09; 7 -8.75,-2.36; 8 -8.75,-3.63; 9 -8.75,-4.9; 10 -8.75,-6.17; 11 -8.75,-7.44; 12 -8.75,-8.71; 13 -8.75,-9.98; 14 -8.75,-11.25; 15 8.75,-11.25; 16 8.75,-9.98; 17 8.75,-8.71; 18 8.75,-7.44; 19 8.75,-6.17; 20 8.75,-4.9; 21 8.75,-3.63; 22 8.75,-2.36; 23 8.75,-1.09; 24 8.75,0.18; 25 8.75,1.45; 26 8.75,2.72; 27 8.75,3.99; 28 8.75,5.26 | smd 0.8 x 0.8: 29_1 -2.755,0.79; 29_2 -1.505,0.79; 29_3 -0.255,0.79; 29_4 -2.755,-0.46; 29_5 -1.505,-0.46; 29_6 -0.255,-0.46; 29_7 -2.755,-1.71; 29_8 -1.505,-1.71; 29_9 -0.255,-1.71
SOIC127P1032X265-16N = smd 2.05 x 0.59: 1 -4.655,4.445; 2 -4.655,3.175; 3 -4.655,1.905; 4 -4.655,0.635; 5 -4.655,-0.635; 6 -4.655,-1.905; 7 -4.655,-3.175; 8 -4.655,-4.445; 9 4.655,-4.445; 10 4.655,-3.175; 11 4.655,-1.905; 12 4.655,-0.635; 13 4.655,0.635; 14 4.655,1.905; 15 4.655,3.175; 16 4.655,4.445
SON50P200X200X80-9N = smd 0.813 x 0.356: 1 -0.985,0.75; 2 -0.985,0.25; 3 -0.985,-0.25; 4 -0.985,-0.75; 5 0.985,-0.75; 6 0.985,-0.25; 7 0.985,0.25; 8 0.985,0.75 | smd 0.9 x 1.3: 9 0,0

### Placement (x,y rotation side)
_C9  9.5,99.5 270 top
_D6  74.27,23.52 0 top
_D8  14.15,98.05 180 top
_D9  35.5,21 90 top
_D10  38.11,9.94 90 top
_D11  33.75,9.9 90 top
_D12  35.7,9.89 90 top
_J2  168.17,54.3 90 top
_J4  5,95.9 270 top
_Q3  69.5,17.5 90 top
BOOT_BUTTON  24,108.9 180 top
C1  146.5,6 90 top
C1_BAT  125.75,10.5 90 top
C1_BAT1  129.5,7 0 top
C1_BAT2  123.8,10.5 90 top
C2  150.5,6 90 top
C2_BAT  128.5,17 90 top
C3  134.5,10.5 90 top
C4  95,31.5 90 top
C4_USB  152.5,52 90 top
C5  52.5,108.5 270 top
C5_USB  157,55 180 top
C6  27.5,108.5 270 top
C7  80,26.5 0 top
C8  82.5,50 0 top
C10  67.5,108.5 270 top
C10_SUPERCAP  90,55 90 top
C11  74.5,19 90 top
C12  72.5,19 90 top
C_DELAY  52,104.5 90 top
CHANGE_BUTTON  64,108.9 180 top
CHG_LED  125.5,21.5 90 top
D1  156.5,52.5 0 top
D2  137.5,10.5 90 top
D3  81,36.5 0 top
D4  91,31 0 top
D5  91,26.5 0 top
D7  83.5,64.5 0 top
EPD_C1  92.5,22 90 top
EPD_C2  90.7,22 90 top
EPD_C5  88,22 90 top
EPD_C6  86,22 90 top
EPD_C7  84,22 90 top
EPD_C8  82,22 90 top
EPD_C9  80,22 90 top
EPD_C10  78,22 90 top
IC2  49,105 0 top
IC4  130,10.5 0 top
J1  85,13 0 top
J4  165.32,19.3 90 top
L1  81,31.5 0 top
MCP73831  129.5,20.5 90 top
PFMF.050.1  155.5,45.5 180 top
Q1  140,19 0 top
Q2  76.5,27.5 270 top
R1  17,17 90 top
R1-PINH  152.5,6 90 top
R1_BAT  122,21.5 0 top
R1_PINH1  80,64.5 0 top
R1_PWRUSB  138.5,23 90 top
R2  68,13 0 top
R2-PINH  148.5,6 90 top
R2-PINH1  89,62 90 top
R2-USB  157,50 0 top
R2-USB1  157,48.5 0 top
R2_BAT  125.5,20 0 top
R3  71.5,11.5 90 top
R4  73.5,15.73 0 top
R5  33,21 90 top
R6  37.15,5.56 90 top
R7  35.87,5.56 90 top
R8  34.58,5.56 90 top
R9  71,27.5 90 top
R10  8,99.5 90 top
R_BOOT  20.5,108.5 90 top
R_CAPACITOR  87,53 90 top
R_CHANGE  60.5,108.5 90 top
R_CL1  73.5,27.5 90 top
R_RESET  45.5,108.5 90 top
RESET_BUTTON  49,108.9 180 top
SENSOR2  149.5,10 90 top
SJ1  68,11 0 top
TP1  17,77 0 top
TP2  20,77 0 top
TP3  132,42 0 top
TP4  71,106 0 top
TP5  75,106 0 top
TP6  2.5,105.5 0 top
TP7  14.5,6 0 top
TP8  2.5,101.5 0 top
TP9  27,43 0 top
TP10  11.5,6 0 top
TP11  5.5,6 0 top
TP12  8.5,6 0 top
TP13  27,47 0 top
TP14  129,42 0 top
TP15  64,76 0 top
TP16  68,76 0 top
TP17  64,72 0 top
U1  37,26.5 0 top
U2  13,29.5 90 top
U3  79,57 270 top
U4  143,23 0 top

### Tracks (layer width: path | path; a pad name or v marks a point on that pad's centre or on a via)
3V3  (via drill 0.3)
  Top 0.3: 82.17,62.91 82.2,62.88 82.2,61.7 U3.2 82.2,61.56 v82.2,59.69 | 82.17,62.91 81.65,63.43 81.65,63.92 81.09,64.47 80.68,64.47 R1_PINH1.2 80.54,64.54 80.54,65.09 80.26,65.37 79.36,65.37 68.77,75.97 68,75.97 TP16.TP 67.93,76.11 67.93,76.87 60.66,84.14 60.66,107.68 60.59,107.75 R_CHANGE.1 60.41,107.94 56.7,107.94 55.48,106.71 49.79,106.71 48.48,105.4 48.48,105.33 48.2,105.05 47.71,105.05 IC2.2 47.58,105.05 47.02,105.05 45.5,106.58 45.5,107.82 R_RESET.1 45.36,107.89 44.87,107.89 42.94,109.83 31.16,109.83 28.25,106.92 21.05,106.92 20.64,107.34 20.64,107.82 R_BOOT.1 20.5,107.89 17.87,107.89 10.25,100.27 9.63,100.27 _C9.1 9.49,100.2 8.03,100.2 R10.2 7.89,100.14 7.41,100.14 7.13,99.86 7.13,91.83 5.75,90.44 4.85,90.44 _J4.P4 | 82.17,62.91 82.34,63.09 82.48,63.09 83.86,64.47 84.48,64.47 D7.2 84.62,64.4 85.11,64.4 86.84,62.67 88.99,62.67 R2-PINH1.2 | 131.23,10.8 129.22,8.79 125.09,8.79 124.03,9.85 C1_BAT2.1 123.66,9.83 96.12,9.83 94.94,11.01 81.51,11.01 76.11,16.41 76.11,24.52 74.37,26.25 74.37,26.8 74.2,26.97 | 131.23,10.8 131.23,11.29 131.37,11.43 IC4.5 | J4.2 165.3,18.84 161.01,18.84 155.05,12.88 140.3,12.88 137.74,10.32 136.42,10.32 135.11,9 134.55,9 C3.+ 134.41,9.07 133.86,9.07 132.2,10.73 131.37,10.73 131.23,10.8 | U2.2 9.07,20.71 9.14,20.64 9.14,19.8 12.6,16.34 16.97,16.34 R1.1 17.11,16.34 32.13,16.34 | 71.71,28.01 72.78,26.94 73.41,26.94 73.47,26.87 R_CL1.1 73.61,26.87 74.1,26.87 74.2,26.97 | 71.71,28.01 71.61,28.12 71.05,28.12 R9.2 70.84,28.18 41.97,28.18 41.55,27.77 40.93,27.77 | 74.2,26.97 74.72,27.49 77.56,27.49 Q2.3
  Top 0.3: R6.2 37.12,6.23 36.01,6.23 R7.2 35.8,6.23 34.62,6.23 R8.2 34.56,6.37 34.56,6.79 32.13,9.21 32.13,16.34 | 40.93,27.77 40.93,28.39 U1.8 | 40.93,27.77 40.93,27.15 U1.7 | 40.93,27.77 40.23,27.77 39.27,28.74 39.27,28.88 38.92,29.22 35.11,29.22 34.14,28.25 34.14,26.94 33.17,25.97 U1.3 33.1,25.83 32.89,25.83 32.06,25 32.06,24.17 33.03,23.2 33.03,21.68 R5.2 32.96,21.54 32.41,21.54 32.13,21.26 32.13,16.34 | v73.27,48.89 73.27,29.64 71.88,28.25 71.88,28.18 71.71,28.01
  Bottom 0.3: v82.2,59.69 82.2,57.82 v73.27,48.89
32KHZ
  Top 0.15: R2-PINH1.1 88.99,61.35 83.72,61.35 83.45,61.63 U3.1 83.72,61.29 83.38,60.94 83.38,60.25 82.34,59.21 77.77,59.21 76.45,60.52 76.45,62.81 65.86,73.41 63.5,73.41 62.6,72.5 62.6,70.98 17.87,26.25 17.87,20.77 U2.9
DN
  Top 0.15: _J2.A7 164.47,54.57 163.98,54.57 163.71,54.29 163.71,53.81 163.91,53.6 164.47,53.6 _J2.B7 164.54,53.53 165.44,53.53 166.62,54.71 166.62,60.66 166.27,61.01 163.91,61.01 162.51,59.61 162.51,55.59 158.51,51.59 157.75,51.59 D1.4
DP  (via drill 0.3)
  Top 0.15: _J2.A6 164.54,54.08 165.37,54.08 v165.44,54.15 165.44,54.91 165.3,55.05 164.54,55.05 _J2.B6 | v158.17,54.15 157.75,53.74 D1.6
  Bottom 0.15: v165.44,54.15 v158.17,54.15
EPD_3V3
  Top 0.3: J1.16 83.31,14.47 83.72,14.47 J1.15 83.72,14.61 83.72,14.82 83.65,14.89 83.65,15.1 83.72,15.17 83.72,15.58 88.02,19.88 88.02,21.33 EPD_C5.1 88.16,21.4 88.43,21.4 89.47,22.44 89.47,23.53 84.61,28.39 83.65,28.39 82.17,29.88 | Q2.2 75.55,26.59 79.22,26.59 79.29,26.52 C7.1 79.29,26.73 79.29,26.84 80.03,27.58 80.03,27.74 82.17,29.88 | 83.24,31.51 83.17,31.58 83.17,34.35 73.82,43.7 73.82,61.35 64.06,71.12 64.06,71.95 TP17.TP | 83.24,31.51 L1.2 | 82.17,29.88 83.17,30.89 83.17,31.37 83.24,31.51
EPD_3V3_C  (via drill 0.3)
  Top 0.3: Q2.1 75.48,28.39 74.86,28.39 74.65,28.18 73.54,28.18 R_CL1.2 73.41,28.18 v72.57,28.18 | U2.18 20.43,38.3 20.43,39.61 26.94,46.12 26.94,46.95 TP13.TP 27.08,46.54 27.7,46.54 v29.43,44.8
  Bottom 0.3: v72.57,28.18 56.37,28.18 42.1,42.45 31.79,42.45 v29.43,44.8
EPD_BUSY  (via drill 0.3)
  Top 0.15: v86.7,17.8 86.7,15.17 86.77,15.1 86.77,14.89 86.7,14.82 86.7,14.47 J1.9 | v31.99,43 TP9.TP 27.01,42.94 27.01,39.33 24.79,37.12 10.73,37.12 10.32,37.53 10.32,38.23 U2.26
  Bottom 0.15: v31.99,43 71.32,43 87.27,27.05 87.27,26.7 86.7,26.12 v86.7,17.8
EPD_CS  (via drill 0.3)
  Top 0.15: v20.43,16.9 20.43,20.71 U2.11 | v15.86,11.56 11.49,7.2 11.49,6.03 TP10.TP | v84.62,15.72 85.25,15.1 85.25,14.47 J1.12 | v75.55,22.64 75.07,23.13 75.07,23.48 _D6.2 75.02,24.18 75.15,24.31 75.15,24.69 74.89,24.95 73.94,24.95 72.02,26.87 71.05,26.87 R9.1
  Bottom 0.15: v15.86,11.56 20.43,16.14 v20.43,16.9 69.73,16.9 75.48,22.64 v75.55,22.64 82.48,15.72 v84.62,15.72
EPD_DC  (via drill 0.3)
  Top 0.15: v85.52,15.44 85.73,15.23 85.73,14.47 J1.11 | v13.3,19.6 12.88,20.01 12.88,20.71 U2.5 | v11.84,16.27 11.84,12.95 5.54,6.65 5.54,6.03 TP11.TP
  Bottom 0.15: v85.52,15.44 80.68,20.29 80.26,20.29 77.42,23.13 73.68,23.13 69.25,18.7 14.2,18.7 | v13.3,19.6 14.2,18.7 | v11.84,16.27 14.2,18.63 14.2,18.7
EPD_RST  (via drill 0.3)
  Top 0.15: v86.22,16.69 86.28,16.62 86.28,14.47 J1.10 | v30.26,45.64 27.49,48.41 26.11,48.41 17.07,39.37 | 17.07,39.37 16.69,38.99 16.69,38.3 U2.21 | v8.52,9 8.52,6.03 TP12.TP | v17.04,39.4 17.07,39.37
  Bottom 0.15: v86.22,16.69 87.25,17.73 87.25,26.29 87.55,26.58 87.55,27.16 69.08,45.64 v30.26,45.64 | v8.52,9 8.52,19.67 17.04,28.18 v17.04,39.4
FLASH_CS  (via drill 0.3)
  Top 0.15: R5.1 33.03,20.36 33.22,20.36 34.6,21.74 35.46,21.74 _D9.2 35.32,21.81 v35.32,23.89 | U2.12 21.74,20.77 21.74,21.47 28.67,28.39 33.1,28.39 U1.1 33.17,28.39 33.31,28.25 33.31,28.05 v33.59,27.77
  Bottom 0.15: v35.32,23.89 33.59,25.62 v33.59,27.77
GDR  (via drill 0.3)
  Top 0.15: v89.75,15.23 90.09,15.23 90.23,15.1 90.23,14.47 J1.2 | v73.2,14.89 72.78,15.3 72.78,15.72 R4.1 72.71,15.58 69.73,15.58 69.53,15.79 69.53,15.93 69.04,16.41 68.9,16.41 _Q3.1
  Bottom 0.15: v89.75,15.23 85.94,15.23 85.11,14.4 73.68,14.4 v73.2,14.89
GND  (via drill 0.35)
  Top 0.15: U2.29_5 13.5,28.05 13.5,29.22 U2.29_6
  Top 0.152: C5.2 53.65,107.85 v54,107.5 | v53,105 52.15,105 C_DELAY.2 | _J2.B1 _J2.A12 164.4,57.55 v163.5,57.55 | C2_BAT.2 128.5,19 128.43,19.07 127.52,19.07 127.4,19.19 127.4,19.91 127.52,20.03 127.53,20.03 v128,20.5 | v129.8,20.5 MCP73831.2 | v127.7,10.6 128.5,10.6 IC4.2 128.15,10.95 128.07,10.95 127.95,11.07 127.95,11.83 128.11,12 C3.- | _D12.1 36.07,9.5 36.42,9.5 v36.62,9.71 | _D10.1 37.91,9 37.2,9 v37.1,8.9 | U1.4 33.1,23.89 34,23 v34,22 | v34.5,21 35,20.5 35.25,20.5 _D9.1 | SENSOR2.1 148.5,11.26 v148.5,10.5 | v149,9.5 149.1,9.4 SENSOR2.7 | _J4.G3 1.15,83.45 v1.4,83.7 | v2.3,91.1 3.8,92.6 _J4.P6 | U2.1 7.74,22.34 v8.1,22.7 | v10.8,25.4 12.14,26.75 U2.29_1 | v79.5,27.8 79.3,28 78.41,28 77.39,29.02 77.39,34.64 D3.1 | v80.7,27.4 80.7,26.55 C7.2 | SENSOR2.5 152.04,8.54 v152.2,8.7 | v156.1,12.6 161.3,17.8 J4.1 | _D6.1 74.5,24.5 v74.7,24.5 | v79,22.8 78.85,22.65 EPD_C10.2 | _J2.MP4 164.56,58.9 163.5,58.9 163.3,58.7 163.3,58.63 v162.97,58.3 | _J2.MP3 v166.65,49.2 | _J2.MP1 v167.56,49.2 | BOOT_BUTTON.2 27.2,108.15 C6.2 | _J4.G4 2.15,94.15 v2.3,94 | v48.35,108.1 47.3,108.1 RESET_BUTTON.1 | v49.45,108.15 RESET_BUTTON.2 | EPD_C5.2 88.04,22.61 v88.84,22.61 | EPD_C2.2 90,23.35 v90,23.5 | C1_BAT.2 126.44,11.15 v126.64,10.95 | _C9.2 11,100.35 15.5,100.35 17.15,98.7 17.15,97.4 5.95,86.2 v4.55,86.2
  Bottom 0.152: v54,107.5 54,106 v53,105 | v128,20.5 v129.8,20.5 | v127.7,10.6 127.35,10.95 v126.64,10.95 | v36.62,9.71 37,9.33 37,9 v37.1,8.9 | v34,22 34.5,21.5 v34.5,21 | v148.5,10.5 149,10 v149,9.5 | v1.4,83.7 2.3,84.6 2.3,88.45 | 2.3,88.45 v2.3,91.1 v2.3,94 | v8.1,22.7 v10.8,25.4 | v79.5,27.8 80.3,27.8 v80.7,27.4 | v152.2,8.7 v156.1,12.6 | v74.7,24.5 74.8,24.6 78,24.6 79.1,23.5 79.1,22.9 v79,22.8 | v163.5,57.55 163.5,57.77 v162.97,58.3 | v49.45,108.15 49.4,108.1 v48.35,108.1 | v88.84,22.61 88.89,22.61 89.78,23.5 v90,23.5 | v4.55,86.2 2.3,88.45 | v166.65,49.2 v167.56,49.2
  other vias: 15.15,40.2 15.15,41.05 16.1,41.05 16.15,42.05
  pour Top: 68.54,109.44 68.52,109.42 19.48,109.42 19.46,109.44 19.44,109.46 19.42,109.48 19.42,110.42 0.58,110.42 0.58,0.58 75.42,0.58 75.42,10.52 75.44,10.54 75.46,10.56 75.48,10.58 95.02,10.58 95.04,10.56 95.06,10.54 95.08,10.52 95.08,0.58 169.42,0.58 169.42,66.42 91.48,66.42 91.46,66.44 91.44,66.46 91.42,66.48 91.42,110.42 68.58,110.42 68.58,109.48 68.56,109.46
  pour Bottom: 75.46,10.56 75.48,10.58 95.02,10.58 95.04,10.56 95.06,10.54 95.08,10.52 95.08,0.58 169.42,0.58 169.42,66.42 91.48,66.42 91.46,66.44 91.44,66.46 91.42,66.48 91.42,110.42 68.58,110.42 68.58,109.48 68.56,109.46 68.54,109.44 68.52,109.42 19.48,109.42 19.46,109.44 19.44,109.46 19.42,109.48 19.42,110.42 0.58,110.42 0.58,0.58 75.42,0.58 75.42,10.52 75.44,10.54
GPIO8
  Top 0.15: R1.2 17.04,17.66 17.04,18 18.7,19.67 18.77,19.67 19.11,20.01 19.11,20.71 U2.10
I2C_PW  (via drill 0.3)
  Top 0.15: R1-PINH.2 152.49,6.72 152.07,6.72 151.66,6.3 151.66,6.03 151.03,5.4 150.55,5.4 C2.1 150.48,5.4 149.93,5.4 149.3,6.03 149.3,6.16 149.03,6.44 148.75,6.44 148.54,6.65 R2-PINH.2 | R2-PINH.2 148.47,6.72 148.06,6.72 147.71,6.37 147.71,6.09 147.02,5.4 146.53,5.4 C1.1 146.46,5.33 146.26,5.12 146.26,4.71 141.82,0.28 94.94,0.28 v94.73,0.48 | 148.33,7.55 148.33,6.79 R2-PINH.2 | 148.33,7.55 148.33,8.52 SENSOR2.8 148.26,8.59 148.26,9.4 149.09,10.24 149.09,11.43 SENSOR2.2 | 148.33,7.55 149.58,7.55 149.86,7.83 149.86,8.52 SENSOR2.6 | v21.81,40.23 21.74,40.16 21.74,38.3 U2.17 | v63.5,20.5 71.05,12.95 v73.41,12.95
  Bottom 0.15: v21.81,40.23 19.74,40.23 19.39,39.89 19.39,39.61 29.5,29.5 54.5,29.5 v63.5,20.5 | v73.41,12.95 75.97,10.39 94.32,10.39 94.73,9.97 v94.73,0.48
INT_RTC
  Top 0.15: U3.3 80.88,61.7 80.88,62.19 79.36,63.71 79.36,64.47 R1_PINH1.1 79.29,64.54 77.7,64.54 67.52,74.72 65.93,74.72 65.03,75.62 64.4,75.62 64.06,75.97 TP15.TP 63.99,75.97 63.57,75.55 63.57,74.93 36.84,48.2 36.84,45.7 16.62,25.48 16.62,20.77 U2.8
IO/BOOT  (via drill 0.3)
  Top 0.15: R_BOOT.2 20.57,109.21 20.84,109.48 20.84,109.55 21.05,109.76 22.05,109.76 BOOT_BUTTON.4 22.73,109.76 24.58,109.76 v24.52,109.62 24.65,109.76 25.17,109.76 BOOT_BUTTON.3 25.86,109.76 26.94,109.76 27.49,109.21 C6.1 | v24.24,42.66 24.24,38.3 U2.15
  Bottom 0.15: v24.24,42.66 24.24,109.35 v24.52,109.62
IO/CHANGE  (via drill 0.3)
  Top 0.15: C10.1 67.45,109.21 67.1,109.55 67.1,109.62 66.97,109.76 66.12,109.76 CHANGE_BUTTON.3 65.44,109.76 | v58.17,107.34 14.06,63.23 14.06,38.3 U2.23 | v59.69,108.86 59.9,109.07 60.39,109.07 60.45,109.14 R_CHANGE.2 60.52,109.21 61.08,109.76 61.62,109.76 CHANGE_BUTTON.4 63.33,109.81 64.72,109.81
  Top 0.152: 64.72,109.81 65.59,109.81 CHANGE_BUTTON.3
  Bottom 0.15: v59.69,108.86 v58.17,107.34
MISO  (via drill 0.3)
  Top 0.15: 0.38,94.7 0.28,94.8 0.28,103.25 2.49,105.47 TP6.TP | R8.1 34.62,4.92 34.9,5.19 34.9,5.26 35.25,5.61 36.42,5.61 36.49,5.54 36.56,5.61 37.74,5.61 37.81,5.54 37.95,5.68 37.95,7.13 36.55,8.54 36.55,8.99 37.08,9.52 37.08,9.89 36.38,10.6 35.73,10.6 _D12.2 35.94,10.66 35.94,11.29 36.98,12.33 v36.98,19.67 | v32.96,26.52 33.1,26.66 33.1,27.08 U1.2 | v24.45,33.93 12.6,33.93 9.07,37.46 9.07,38.23 U2.27 9,38.3 9,38.92 v8.52,39.4 | 0.38,94.7 0.28,94.6 0.28,85.52 2.56,83.24 2.56,81.37 0.28,79.08 0.28,48.9 v7.25,41.92 | 0.38,94.7 1.53,93.55 4.85,93.55 _J4.P7
  Bottom 0.15: v36.98,19.67 32.96,23.68 v32.96,26.52 32.06,26.52 24.65,33.93 v24.45,33.93 | v8.52,39.4 7.25,40.67 v7.25,41.92
MOSI  (via drill 0.3)
  Top 0.15: U1.5 40.93,24.65 40.93,24.79 41.41,25.28 41.48,25.28 41.76,25.55 41.76,26.18 41.48,26.45 40.3,26.45 39.2,25.35 39.2,24.52 36.49,21.81 36.49,13.5 34.07,11.08 34.07,10.94 _D11.2 33.78,10.66 34.35,10.66 34.83,10.18 v34.83,9.9 | v15.37,16.9 15.37,20.71 U2.7 | v15.17,7.27 14.54,6.65 14.54,6.03 TP7.TP | v84.28,15.23 84.28,14.47 J1.14 | v36.36,4.16 35.87,4.64 35.87,4.85 R7.1
  Bottom 0.15: v15.37,16.9 15.37,7.48 v15.17,7.27 15.17,7.2 22.09,0.28 40.23,0.28 | v84.28,15.23 78.67,15.23 78.53,15.37 72.78,15.37 57.69,0.28 40.23,0.28 | 40.23,0.28 v36.36,4.16 36.36,4.22 34.83,5.75 v34.83,9.9
N$1
  Top 0.15: R2-USB.1 156.37,50.07 156.37,50.48 156.78,50.9 157.47,50.9 157.54,50.97 158.17,50.97 158.24,50.9 158.51,50.9 162.88,55.26 162.88,57.57 163.31,58 164.99,58 165.09,58.1 165.72,58.1 166.34,57.48 166.34,56.92 165.44,56.02 164.54,56.02 _J2.B5
N$3
  Top 0.15: R2-USB1.2 157.61,48.48 157.61,47.99 157.27,47.64 156.85,47.64 156.64,47.44 156.64,43.56 156.85,43.35 161.98,43.35 167.1,48.48 167.1,51.24 165.3,53.05 164.54,53.05 _J2.A5
N$4  (via drill 0.3)
  Top 0.15: 129.57,9.97 129.15,9.56 128.67,9.56 IC4.3 | 129.57,9.97 129.57,11.01 129.22,11.36 128.74,11.36 128.67,11.43 IC4.1 | C1_BAT1.1 128.87,7.06 128.87,7.55 129.29,7.96 132.96,7.96 133.31,7.62 136.01,7.62 137.46,9.07 137.46,9.42 D2.1 137.53,9.49 137.88,9.49 v138.36,9.97 | v140.99,13.43 140.99,17.94 Q1.2 | v129.64,9.97 129.57,9.97
  Bottom 0.15: v140.99,13.43 140.99,12.6 v138.36,9.97 v129.64,9.97
N$5
  Top 0.15: R1_BAT.2 122.64,21.47 122.64,20.98 122.36,20.71 120.84,20.71 120.63,20.91 120.63,22.09 121.12,22.58 131.02,22.58 131.92,21.68 131.92,19.94 131.57,19.6 130.81,19.6 MCP73831.1
N$6
  Top 0.15: C4.1 94.94,30.89 94.11,30.89 93.42,30.19 90.65,30.19 89.82,31.02 89.26,31.02 D4.1 89.19,30.95 88.71,30.95 88.29,31.37 88.29,31.51 83.31,36.49 D3.2
N$7
  Top 0.15: CHG_LED.C 124.72,21.54 124.1,21.54 123.33,22.3 121.67,22.3 121.47,22.09 121.47,21.61 121.39,21.54 R1_BAT.1
N$8
  Top 0.15: R2_BAT.2 126.1,20.01 126.1,20.29 125.48,20.91 125.48,22.02 125.69,22.23 128.81,22.23 129,22.03 129,20.95 128.92,20.86 128.92,20.34 128.2,19.62 MCP73831.5
N$9  (via drill 0.3)
  Top 0.15: v78.39,14.89 78.81,14.47 79.22,14.47 J1.24 | v76.45,14.89 73.13,18.21 72.57,18.21 72.5,18.28 C12.1
  Bottom 0.15: v76.45,14.89 v78.39,14.89
N$11
  Top 0.15: J1.22 80.26,14.47 80.26,18.77 77.97,21.05 77.97,21.33 EPD_C10.1
N$13
  Top 0.15: J1.20 81.23,14.47 81.23,20.29 81.99,21.05 81.99,21.33 EPD_C8.1
N$14
  Top 0.15: J1.19 81.78,14.47 81.78,18.84 84,21.05 84,21.33 EPD_C7.1
N$15
  Top 0.15: J1.18 82.2,14.47 82.2,14.82 82.27,14.89 82.27,15.1 82.2,15.17 82.2,17.24 86.01,21.05 86.01,21.33 EPD_C6.1
N$16
  Top 0.15: R_CAPACITOR.2 86.98,53.67 86.98,58.03 89.82,60.87 89.82,63.16 87.67,65.3 83.58,65.3 82.82,64.54 82.48,64.54 D7.1
N$19
  Top 0.15: C_DELAY.1 51.94,103.88 51.66,103.88 51.18,104.36 51.24,104.43 50.69,104.98 50.69,105.67 50.41,105.95 IC2.5
N$22
  Top 0.15: J1.4 89.26,14.47 89.26,18.35 91.93,21.02 EPD_C1.1
N$23
  Top 0.15: J1.5 88.78,14.47 88.78,19.74 EPD_C2.1
PREVGH  (via drill 0.3)
  Top 0.15: 80.5,20.53 79.98,21.05 79.98,21.33 EPD_C9.1 | 80.5,20.53 80.75,20.29 80.75,14.47 J1.21 | 80.5,20.53 v80.75,20.77 | D5.1 89.23,26.52 87.19,26.52 v86.84,26.87
  Bottom 0.15: v80.75,20.77 v86.84,26.87
PREVGL  (via drill 0.3)
  Top 0.15: v75.34,18.21 74.58,18.21 74.51,18.28 C11.1 | J1.23 79.78,14.47 79.78,15.1 v76.66,18.21 76.66,22.78 77.63,23.75 v87.74,23.75 | v91.76,30.68 92.03,30.95 92.73,30.95 D4.2
  Bottom 0.15: v75.34,18.21 v76.66,18.21 | v91.76,30.68 91.76,27.77 v87.74,23.75
RESE  (via drill 0.3)
  Top 0.15: v87.67,13.64 89.61,13.64 89.75,13.78 89.75,14.4 J1.3 | R3.1 71.53,10.87 71.61,10.94 72.09,10.94 v74.79,13.64 74.79,13.99 73.54,15.23 73.54,16.34 73.34,16.55 72.37,16.55 72.3,16.48 70.15,16.48 _Q3.2
  Bottom 0.15: v74.79,13.64 v87.67,13.64
RESE'
  Top 0.15: 69.98,12.02 68.97,11.01 SJ1.2 | 69.98,12.02 70.15,12.19 71.47,12.19 R3.2 | 69.98,12.02 69.04,12.95 68.7,12.95 R2.2
RESET  (via drill 0.3)
  Top 0.15: C5.1 52.49,109.21 51.94,109.76 50.85,109.76 RESET_BUTTON.3 50.17,109.76 48.48,109.76 48.48,109.69 | 48.48,109.69 48.41,109.76 47.72,109.76 RESET_BUTTON.4 47.04,109.76 46.05,109.76 45.84,109.55 45.84,109.48 45.57,109.21 R_RESET.2 45.5,109.21 v44.87,109.83 | IC2.1 47.58,105.95 47.58,106.64 48.8,107.87 48.8,108.29 48.48,108.62 48.48,109.69 | v7.31,25.11 10.25,22.17 10.25,20.77 U2.3
  Bottom 0.15: v7.31,25.11 6.73,25.69 6.73,110.73 18.84,110.73 19.46,110.11 44.6,110.11 v44.87,109.83
RTC_RST  (via drill 0.3)
  Top 0.15: v23.75,39.75 22.99,38.99 22.99,38.3 U2.16 | v37.33,47.64 63.36,73.68 68.14,73.68 79.57,62.26 79.57,61.7 U3.4
  Bottom 0.15: v23.75,39.75 31.65,47.64 v37.33,47.64
RX
  Top 0.15: U2.24 12.81,38.3 12.81,68.56 20.01,75.76 20.01,76.94 TP2.TP
SCK  (via drill 0.3)
  Top 0.15: v81.02,12.26 83.17,12.26 84.76,13.85 84.76,14.4 J1.13 | v80.26,11.49 79.15,10.39 75.83,10.39 65.72,0.28 41.48,0.28 37.19,4.57 37.19,4.85 R6.1 37.26,4.85 37.6,4.85 38.78,6.02 38.78,9.77 38.02,10.52 | TP8.TP 2.56,101.45 2.56,100.83 6.09,97.3 6.09,91.83 5.82,91.55 5.05,91.55 _J4.P5 4.99,91.48 4.16,91.48 3.85,91.17 3.85,45.93 7.68,42.1 7.68,41.74 7.09,41.15 7.09,28.44 14.06,21.47 14.06,20.77 U2.6 14.13,20.71 14.13,20.01 v14.89,19.25 | 37.81,19.18 37.81,10.87 37.74,10.8 38.02,10.52 | 37.81,19.18 37.81,22.64 40.37,25.21 40.44,25.21 40.86,25.62 40.86,25.83 U1.6 | 38.02,10.52 _D10.2 38.08,10.67 | v37.67,19.18 37.81,19.18
  Bottom 0.15: v80.26,11.49 v81.02,12.26 | v14.89,19.25 36.77,19.25 36.84,19.18 v37.67,19.18
SCL  (via drill 0.3)
  Top 0.15: 153.32,8.17 153.32,4.85 153.11,4.64 149.93,4.64 149.23,5.33 148.54,5.33 R2-PINH.1 | SENSOR2.4 150.69,11.43 150.69,10.85 152.65,8.89 152.65,8.84 153.32,8.17 | U4.7 144.04,23.27 144.39,23.27 144.46,23.2 144.59,23.2 144.66,23.27 146.65,23.27 162.11,23.27 164.47,20.91 165.23,20.91 165.3,20.84 J4.4 165.37,20.77 166.13,20.77 166.48,20.43 166.48,17.31 157.34,8.17 153.32,8.17 | v25.62,46.67 17.94,38.99 17.94,38.3 U2.20 | v82.82,51.18 83.38,51.73 83.38,52.28 U3.16 | v144.81,25.79 146.11,24.49
  Top 0.152: 146.11,24.49 146.11,23.86 146.1,23.85 146.1,23.82 146.65,23.27
  Bottom 0.15: v25.62,46.67 29.78,46.67 31.51,48.41 80.05,48.41 v82.82,51.18 117.98,51.18
  Bottom 0.152: v144.81,25.79 143.47,25.79 118.08,51.18 117.98,51.18
SDA  (via drill 0.3)
  Top 0.15: v149.72,12.33 149.93,12.12 149.93,11.49 SENSOR2.3 | U4.8 144.04,23.75 144.39,23.75 144.46,23.82 v145.38,23.82 | v151.66,5.4 152.49,5.4 R1-PINH.1 | v154.84,13.43 161.21,19.8 165.3,19.8 J4.3 | v19.88,39.75 19.18,39.06 19.18,38.3 U2.19 | v82.48,49.31 82.55,49.38 82.55,50.62 82.27,50.9 82.27,52.22 82.2,52.28 U3.15
  Bottom 0.15: 151.66,10.32 v151.66,5.4 | 151.66,10.32 149.72,12.26 v149.72,12.33 145.58,16.46 145.58,23.62 v145.38,23.82 144.83,23.82 144.76,23.75 108.1,23.75 82.55,49.31 v82.48,49.31 81.3,48.13 31.72,48.13 29.98,46.4 29.78,46.4 23.13,39.75 v19.88,39.75 | v154.84,13.43 151.73,10.32 151.66,10.32
SRC  (via drill 0.3)
  Top 0.15: C4.2 95.01,32.13 95.5,32.13 95.84,31.79 95.84,29.78 92.8,26.73 92.8,26.52 D5.2 92.73,26.73 90.51,26.73 88.36,28.88 84.16,28.88 v84.14,28.9 | v72.57,23.2 69.53,20.15 69.53,18.56 _Q3.3 | v77.82,29.2 77.82,30.59 78.67,31.44 L1.1
  Bottom 0.15: v72.57,23.2 72.57,23.95 v77.82,29.2 78.14,29.2 78.44,28.9 v84.14,28.9
SS_SD  (via drill 0.3)
  Top 0.15: 11.56,97.99 13.46,97.99 _D8.2 | 11.56,97.99 8.59,97.99 8.03,98.54 8.03,98.82 R10.1 | v11.56,23.34 11.56,20.77 U2.4 | v11.56,97.85 11.56,97.99
  Bottom 0.15: v11.56,97.85 v11.56,23.34
TX
  Top 0.15: U2.25 11.56,38.3 11.56,70.91 16.62,75.97 16.62,76.59 16.97,76.94 TP1.TP
USB_D+  (via drill 0.3)
  Top 0.15: v79.84,66.27 80.33,66.76 142.1,66.76 155.19,53.67 155.19,53.46 D1.1 | v32.62,29.02 v52.49,48.89 | v31.44,27.84 24.31,20.71 U2.14
  Bottom 0.15: v79.84,66.27 69.87,66.27 v52.49,48.89 | v31.44,27.84 v32.62,29.02
USB_D-  (via drill 0.3)
  Top 0.15: v153.46,52.7 154.57,51.59 155.19,51.59 D1.3 | v39.82,29.02 v59.69,48.89 | v32.2,27.01 24.86,19.67 23.41,19.67 22.99,20.08 22.99,20.71 U2.13
  Bottom 0.15: v153.46,52.7 139.4,66.76 80.95,66.76 63.09,48.89 v59.69,48.89 | v39.82,29.02 34.21,29.02 v32.2,27.01
VBAT  (via drill 0.3)
  Top 0.3: 129.77,21.26 129.98,21.47 130.74,21.47 MCP73831.3 | C2_BAT.1 128.53,16.41 129.15,16.41 129.27,16.53 129.27,20.72 129.47,20.92 129.47,20.96 129.77,21.26 | U4.3 142.03,22.78 142.03,23.2 U4.2 141.89,23.13 141.89,23.14 141.21,23.14 | 140.02,20.91 140.02,21.95 141.21,23.14 | 140.02,20.91 140.02,20.15 Q1.3 | 141.21,23.14 141.24,23.16 141.06,23.34 141.06,32.13 132.06,41.13 132.06,41.97 TP3.TP | v129.84,21.19 129.77,21.26 | v139.88,20.91 140.02,20.91
  Bottom 0.3: v129.84,21.19 139.61,21.19 v139.88,20.91
VBUS
  Top 0.3: C5_USB.1 157.68,54.98 158.1,54.98 158.79,54.29 158.79,52.77 158.51,52.49 D1.5 157.61,52.49 156.92,52.49 156.3,51.87 156.3,51.11 156.09,50.9 155.81,50.9 155.47,50.55 152.49,50.55 | 152.49,47.78 152.49,50.55 | 152.49,50.55 152.49,51.31 C4_USB.1 | 152.49,47.78 153.18,47.09 153.18,45.57 PFMF.050.1.2 | 127.14,21.54 127.28,21.54 127.35,21.47 128.18,21.47 MCP73831.4 | 127.14,21.54 126.31,21.54 CHG_LED.A | C1_BAT.1 125.77,9.9 126.34,9.9 127.17,10.73 127.17,14.22 127.49,14.54 | 137.53,15.4 137.53,15.93 138.99,17.38 138.99,17.94 Q1.1 139.05,18.14 139.19,18.28 139.19,20.98 139.54,21.33 139.54,23.2 139.12,23.61 138.5,23.61 R1_PWRUSB.2 138.43,23.75 138.29,23.89 138.29,31.92 129.01,41.2 129.01,41.97 TP14.TP 129.15,42.03 129.43,42.03 135.11,47.71 152.35,47.71 152.49,47.78 | 137.53,15.4 137.53,11.56 D2.2 | 127.14,21.54 127.14,20.16 127.04,20.05 127.04,19.05 127.49,18.6 127.49,14.54 | 127.49,14.54 127.75,14.8 136.93,14.8 137.53,15.4
VRTC
  Top 0.3: U3.14 80.88,52.28 80.88,50.55 81.37,50.07 81.78,50.07 C8.1 81.85,49.86 81.85,49.17 82.27,48.75 83.79,48.75 86.91,51.87 86.91,52.28 R_CAPACITOR.1 87.05,52.35 87.6,52.35 88.71,53.46 88.71,55.33 89.47,56.09 89.96,56.09 C10_SUPERCAP.2
VUSB
  Top 0.3: _J2.A4 164.54,51.8 164.54,52.01 _J2.B9 164.4,51.94 163.64,51.94 | _J2.A9 164.54,56.78 164.54,56.58 _J2.B4 164.4,56.65 163.64,56.65 163.29,56.3 163.29,52.28 163.64,51.94 | 163.64,51.94 163.5,51.87 157.75,46.12 157.75,45.57 PFMF.050.1.1